# EasyEDA Pro project 压力传感器monitor.eprj

# Schematic Schematic1
Create Date: 2025-03-22; Page Name: P1; Project Name: 压力传感器monitor; Schematic Name: Schematic1; Update Date: 2025-03-22; Company: 嘉立创EDA; Page Size: A4; Version: V1.0
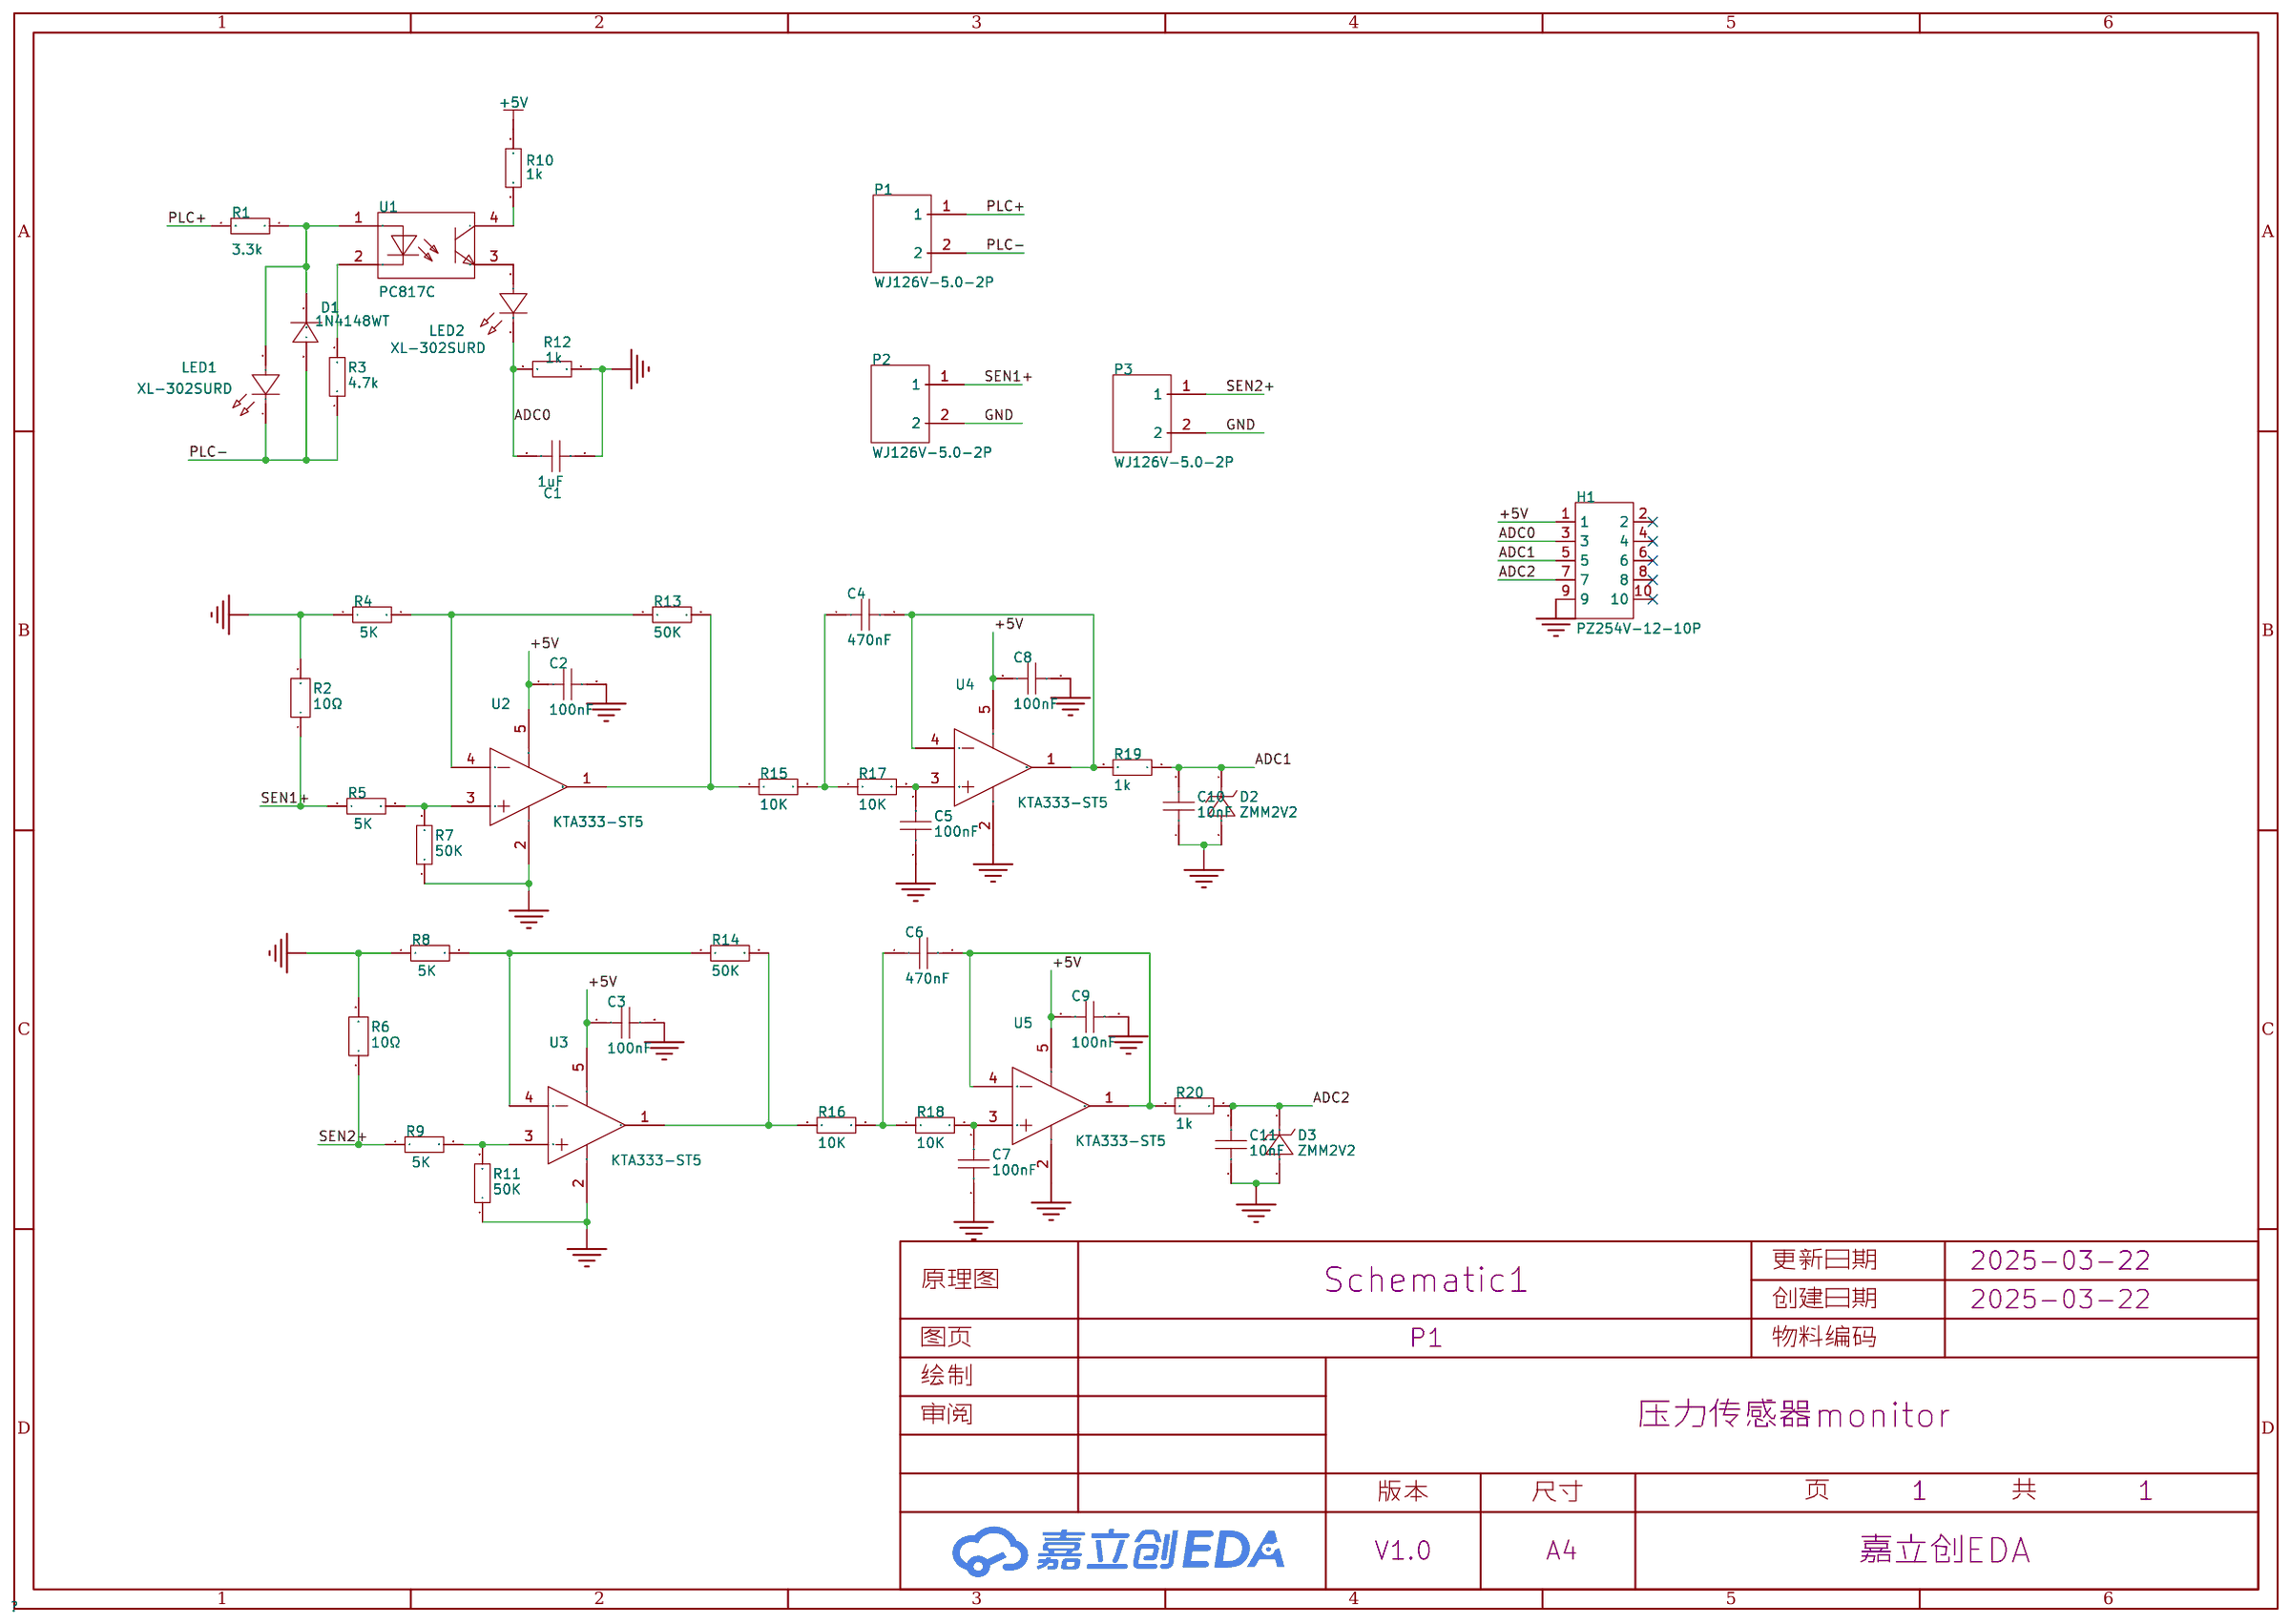
[diagram p0: schematic sheet]

## Parts
C1  1uF  [C0603]
C2  100nF  [C0603]
C3  100nF  [C0603]
C4  470nF  [C0603]
C5  100nF  [C0603]
C6  470nF  [C0603]
C7  100nF  [C0603]
C8  100nF  [C0603]
C9  100nF  [C0603]
C10  10nF  [C0603]
C11  10nF  [C0603]
D1  1N4148WT  [SOD-523_L1.2-W0.8-LS1.6-RD]
D2  ZMM2V2  [LL-34_L3.5-W1.5-RD]
D3  ZMM2V2  [LL-34_L3.5-W1.5-RD]
H1  PZ254V-12-10P  [HDR-TH_10P-P2.54-V-M-R2-C5-S2.54]
LED1  XL-302SURD  [LED-TH_BD3.8-P2.54-RD]
LED2  XL-302SURD  [LED-TH_BD3.8-P2.54-RD]
P1  WJ126V-5.0-2P  [CONN-TH_WJ126V-5.0-2P]
P2  WJ126V-5.0-2P  [CONN-TH_WJ126V-5.0-2P]
P3  WJ126V-5.0-2P  [CONN-TH_WJ126V-5.0-2P]
R1  3.3k  [R0603]
R2  10Ω  [R1206_1]
R3  4.7k  [R0603]
R4  5K  [R0603]
R5  5K  [R0603]
R6  10Ω  [R1206_1]
R7  50K  [R0603]
R8  5K  [R0603]
R9  5K  [R0603]
R10  1k  [R0603]
R11  50K  [R0603]
R12  1k  [R0603]
R13  50K  [R0603]
R14  50K  [R0603]
R15  10K  [R0603]
R16  10K  [R0603]
R17  10K  [R0603]
R18  10K  [R0603]
R19  1k  [R0603]
R20  1k  [R0603]
U1  PC817C  [OPTO-SMD-4_L4.6-W6.5-P2.54-LS10.3-TL]
U2  KTA333-ST5  [SOT-23-5_L2.9-W1.6-P0.95-LS2.8-BL]
U3  KTA333-ST5  [SOT-23-5_L2.9-W1.6-P0.95-LS2.8-BL]
U4  KTA333-ST5  [SOT-23-5_L2.9-W1.6-P0.95-LS2.8-BL]
U5  KTA333-ST5  [SOT-23-5_L2.9-W1.6-P0.95-LS2.8-BL]

## Library data of the parts
C1-C11 = CAP_0603: Supplier Footprint: 0603
D1 = 1N4148WT_C232841: 二极管配置:独立式;正向压降(Vf):1V@10mA;直流反向耐压(Vr):75V;整流电流:300mA;反向恢复时间(trr):4ns;; LCSC Part Name: 电压:75V 电流:300mA; Supplier Part: C232841; Manufacturer: onsemi(安森美); Supplier Footprint: SOD-523F; JLCPCB Part Class: Extended Part; Datasheet: https://atta.szlcsc.com/upload/public/pdf/source/20181222/C232841_42C5BA49E5A441BB8F6B91D0F4CD0D51.pdf; Supplier: LCSC; Diode Configuration: 独立式; Forward Voltage (Vf@If): 1V@10mA; Reverse Voltage (Vr): 75V; Rectified Current: 300mA; Reverse Leakage Current: 5uA@75V; Reverse Recovery Time (trr): 4ns; Operating Temperature: -55℃~+150℃@(Tj)
D2 D3 = ZMM2V2: 稳压值(标称值):-;功率:500mW;精度:-;; Supplier Part: C707185; Manufacturer: Slkor(萨科微); Supplier Footprint: LL-34; JLCPCB Part Class: Extended Part; Datasheet: https://atta.szlcsc.com/upload/public/pdf/source/20200721/C707184_776B95022AAA01ECB528B9CFDAFDB27C.pdf; Supplier: LCSC; Reverse Leakage Current (Ir): 75uA@1V; Power Dissipation: 500mW
H1 = PZ254V-12-10P: 插针结构:2x5P;间距:2.54mm;行距:2.54mm;圆针/方针:方针;安装方式:直插;排数:双排;总PIN位数:10P;额定电流:-;额定电压:-;配合针长度:6mm;塑高:2.5mm;端接针长度:3mm;触头材质:黄铜;触头镀层:-;工作温度:-40℃~+105℃;颜色:黑色;; LCSC Part Name: 2x5P 间距:2.54mm 方针 直插; Supplier Part: C492422; Manufacturer: XFCN(兴飞); Supplier Footprint: 插件,P=2.54mm; JLCPCB Part Class: Extended Part; Datasheet: https://atta.szlcsc.com/upload/public/pdf/source/20200309/C492422_5020CEA01BE7051F9EA9DD81AB0A25E3.pdf; Supplier: LCSC; Pin Structure: 2x5P; Pitch: 2.54mm; Row Spacing: 2.54mm; Circluar Pins/Square Pins: 方针; Mounting Type: 直插; Number of Rows: 双排; Number of Pins: 10P; Length of Mating Pin: 6mm; Insulation Height: 2.5mm; Length of End Connection Pin: 3mm; Contact Material: 黄铜; Operating Temperature: -40℃~+105℃; Color: 黑色
LED1 LED2 = XL-302SURD: 灯头类型:3mm圆形灯头;发光颜色:红色;功率:80mW;正向电流:30mA;主波长:615nm~620nm;透镜颜色:红色透镜;色温:-;发光角度:50°;载带方式:-;工作温度:-25℃~+85℃;; Supplier Part: C2895470; Manufacturer: XINGLIGHT(成兴光); Supplier Footprint: 插件,D=3mm; JLCPCB Part Class: Extended Part; Datasheet: https://atta.szlcsc.com/upload/public/pdf/source/20240112/E1E2B82945FD635E4907401DDE6D4922.pdf; Supplier: LCSC; Lamp Holder Type: 3mm圆形灯头; Emitted Color: 红色; Power Dissipation: 80mW; Forward Current: 30mA; Dominant Wavelength: 615nm~620nm; Peak Wavelength: 625nm; Lens Color: 红色透镜; Viewing Angle: 50°; Operating Temperature: -25℃~+85℃
P1-P3 = WJ126V-5.0-2P: 结构:1x2P;间距:5mm;颜色:绿色;安装方式:直插;额定电流:18A;额定电压:250V;排数:1;线规 - AWG:14~26;线规 - 平方毫米:2.5;每排PIN数:2;工作温度范围:-40℃~+105℃;; LCSC Part Name: 5mm 1x2P 排数:1 每排P数:2 直插; Supplier Part: C8404; Manufacturer: KANGNEX(康奈克斯电气); Supplier Footprint: 插件,P=5mm; JLCPCB Part Class: Extended Part; Datasheet: https://atta.szlcsc.com/upload/public/pdf/source/20191225/C8404_8F52D87DF851D149A4DEA9BD9FA83F9A.pdf; Supplier: LCSC; Structure: 1x2P; Pitch: 5mm; Color: 绿色; Mounting Style: 直插; Current Rating (Max): 18A; Voltage Rating (Max): 250V; Number of Pins: 2P; Number of Rows: 1; Wire Gauge - AWG: 14~26; Wire Gauge - mm2: 2.5; Number of PINs Per Row: 2; Operating Temperature Range: -40℃~+105℃
R1 R3-R5 R7-R20 = Res_0603: Supplier Footprint: 0603
R2 R6 = SR12X10R0FTL: 电阻类型:金属膜电阻;阻值:10Ω;精度:±1%;功率:250mW;温度系数:-200ppm/℃~+400ppm/℃;; LCSC Part Name: 10Ω ±1% 250mW; Supplier Part: C5356708; Manufacturer: Walsin(华新科); Supplier Footprint: 1206; JLCPCB Part Class: Extended Part; Datasheet: https://atta.szlcsc.com/upload/public/pdf/source/20190927/C431829_E85B1AD1A99EB5DCD2887E5955DF3207.pdf; Supplier: LCSC; Type: 金属膜电阻; Tolerance: ±1%; Power(Watts): 250mW; Temperature Coefficient: -200ppm/℃~+400ppm/℃
U1 = PC817C_C3025164: 输入电压类型:DC;正向压降(Vf):1.2V;输出电流:50mA;隔离电压(Vrms):5kV;反向电压:6V;负载电压:35V;输出通道数:1;集射极饱和电压(VCE(sat)):100mV@1mA,20mA;; LCSC Part Name: C档; Supplier Part: C3025164; Manufacturer: GOODWORK(固得沃克); Supplier Footprint: SMD-4P; JLCPCB Part Class: Extended Part; Datasheet: https://atta.szlcsc.com/upload/public/pdf/source/20240617/7F1B42AFA4D9649DF13B74B1E0B1F256.pdf; Supplier: LCSC; Input voltage type: DC; Output Type: 光电三极管; Forward Voltage: 1.2V; Output Current: 50mA; Isolation Voltage(rms): 5kV; Reverse Voltage: 6V; Load Voltage: 35V; Number of Outputs: 1; Collector-Emitter Saturation Voltage (Vce(sat)@Ic,IF): 100mV@1mA,20mA; Rise time: 6us@2mA,100Ω; Fall time: 5us@2mA,100Ω; Operating Temperature: -55℃~+110℃; Current Transfer Ratio (CTR) Minimum: 200%; Current Transfer Ratio (CTR) Maximum/Saturation Value: 400%
U2-U5 = KTA333-ST5: 零漂移、微功耗、CMOS 运算放大器，SOT-23-5L封装 VDD1.8~5.5供电; Supplier Part: C5180465; Manufacturer: CONNTEK(昆泰芯); Supplier Footprint: SOT-23-5; JLCPCB Part Class: Extended Part; Datasheet: https://atta.szlcsc.com/upload/public/pdf/source/20220922/5DB1813585517C535CC957AF853FD7D4.pdf; Supplier: LCSC; Maximum Power Supply Range (Vdd-Vss): 5.5V

## Nets
+5V: C2.1 C3.1 C8.1 C9.1 H1.1 R10.2 U2.5(V+) U3.5(V+) U4.5(V+) U5.5(V+)
GND: C1.1 C2.2 C3.2 C5.1 C7.1 C8.2 C9.2 C10.1 C11.1 D2.2(A) D3.2(A) H1.9 P2.2 P3.2 R2.2 R4.1 R6.2 R7.1 R8.1 R11.1 R12.1 U2.2(V-) U3.2(V-) U4.2(V-) U5.2(V-)
ADC0: C1.2 H1.3 LED2.1(K) R12.2
ADC1: C10.2 D2.1(K) H1.5 R19.1
ADC2: C11.2 D3.1(K) H1.7 R20.1
PLC+: P1.1 R1.2
PLC-: D1.2(A) LED1.1(K) P1.2 R3.1
SEN1+: P2.1 R2.1 R5.1
SEN2+: P3.1 R6.1 R9.1
$1N200: R3.2 U1.2
$1N422: D1.1(C) LED1.2(A) R1.1 U1.1
$1N1051: LED2.2(A) U1.3
$1N1090: R10.1 U1.4
$1N1367: R4.2 R13.1 U2.4(IN-)
$1N1409: R5.2 R7.2 U2.3(IN+)
$1N1586: R13.2 R15.1 U2.1(OUT)
$1N1695: C5.2 R17.2 U4.3(IN+)
$1N1869: C4.1 R15.2 R17.1
$1N3034: R8.2 R14.1 U3.4(IN-)
$1N3038: R9.2 R11.2 U3.3(IN+)
$1N3049: R14.2 R16.1 U3.1(OUT)
$1N3053: C7.2 R18.2 U5.3(IN+)
$1N3059: C6.1 R16.2 R18.1
$1N3392: C4.2 R19.2 U4.1(OUT) U4.4(IN-)
$1N3516: C6.2 R20.2 U5.1(OUT) U5.4(IN-)

Not connected (* = marked no-connect by the designer): H1 2* 4* 6* 8* 10*

# Schematic Schematic2
Create Date: 2025-03-24; Page Name: P1; Project Name: 压力传感器monitor; Schematic Name: Schematic2; Update Date: 2025-04-01; Company: 嘉立创EDA; Page Size: A4; Version: V1.0
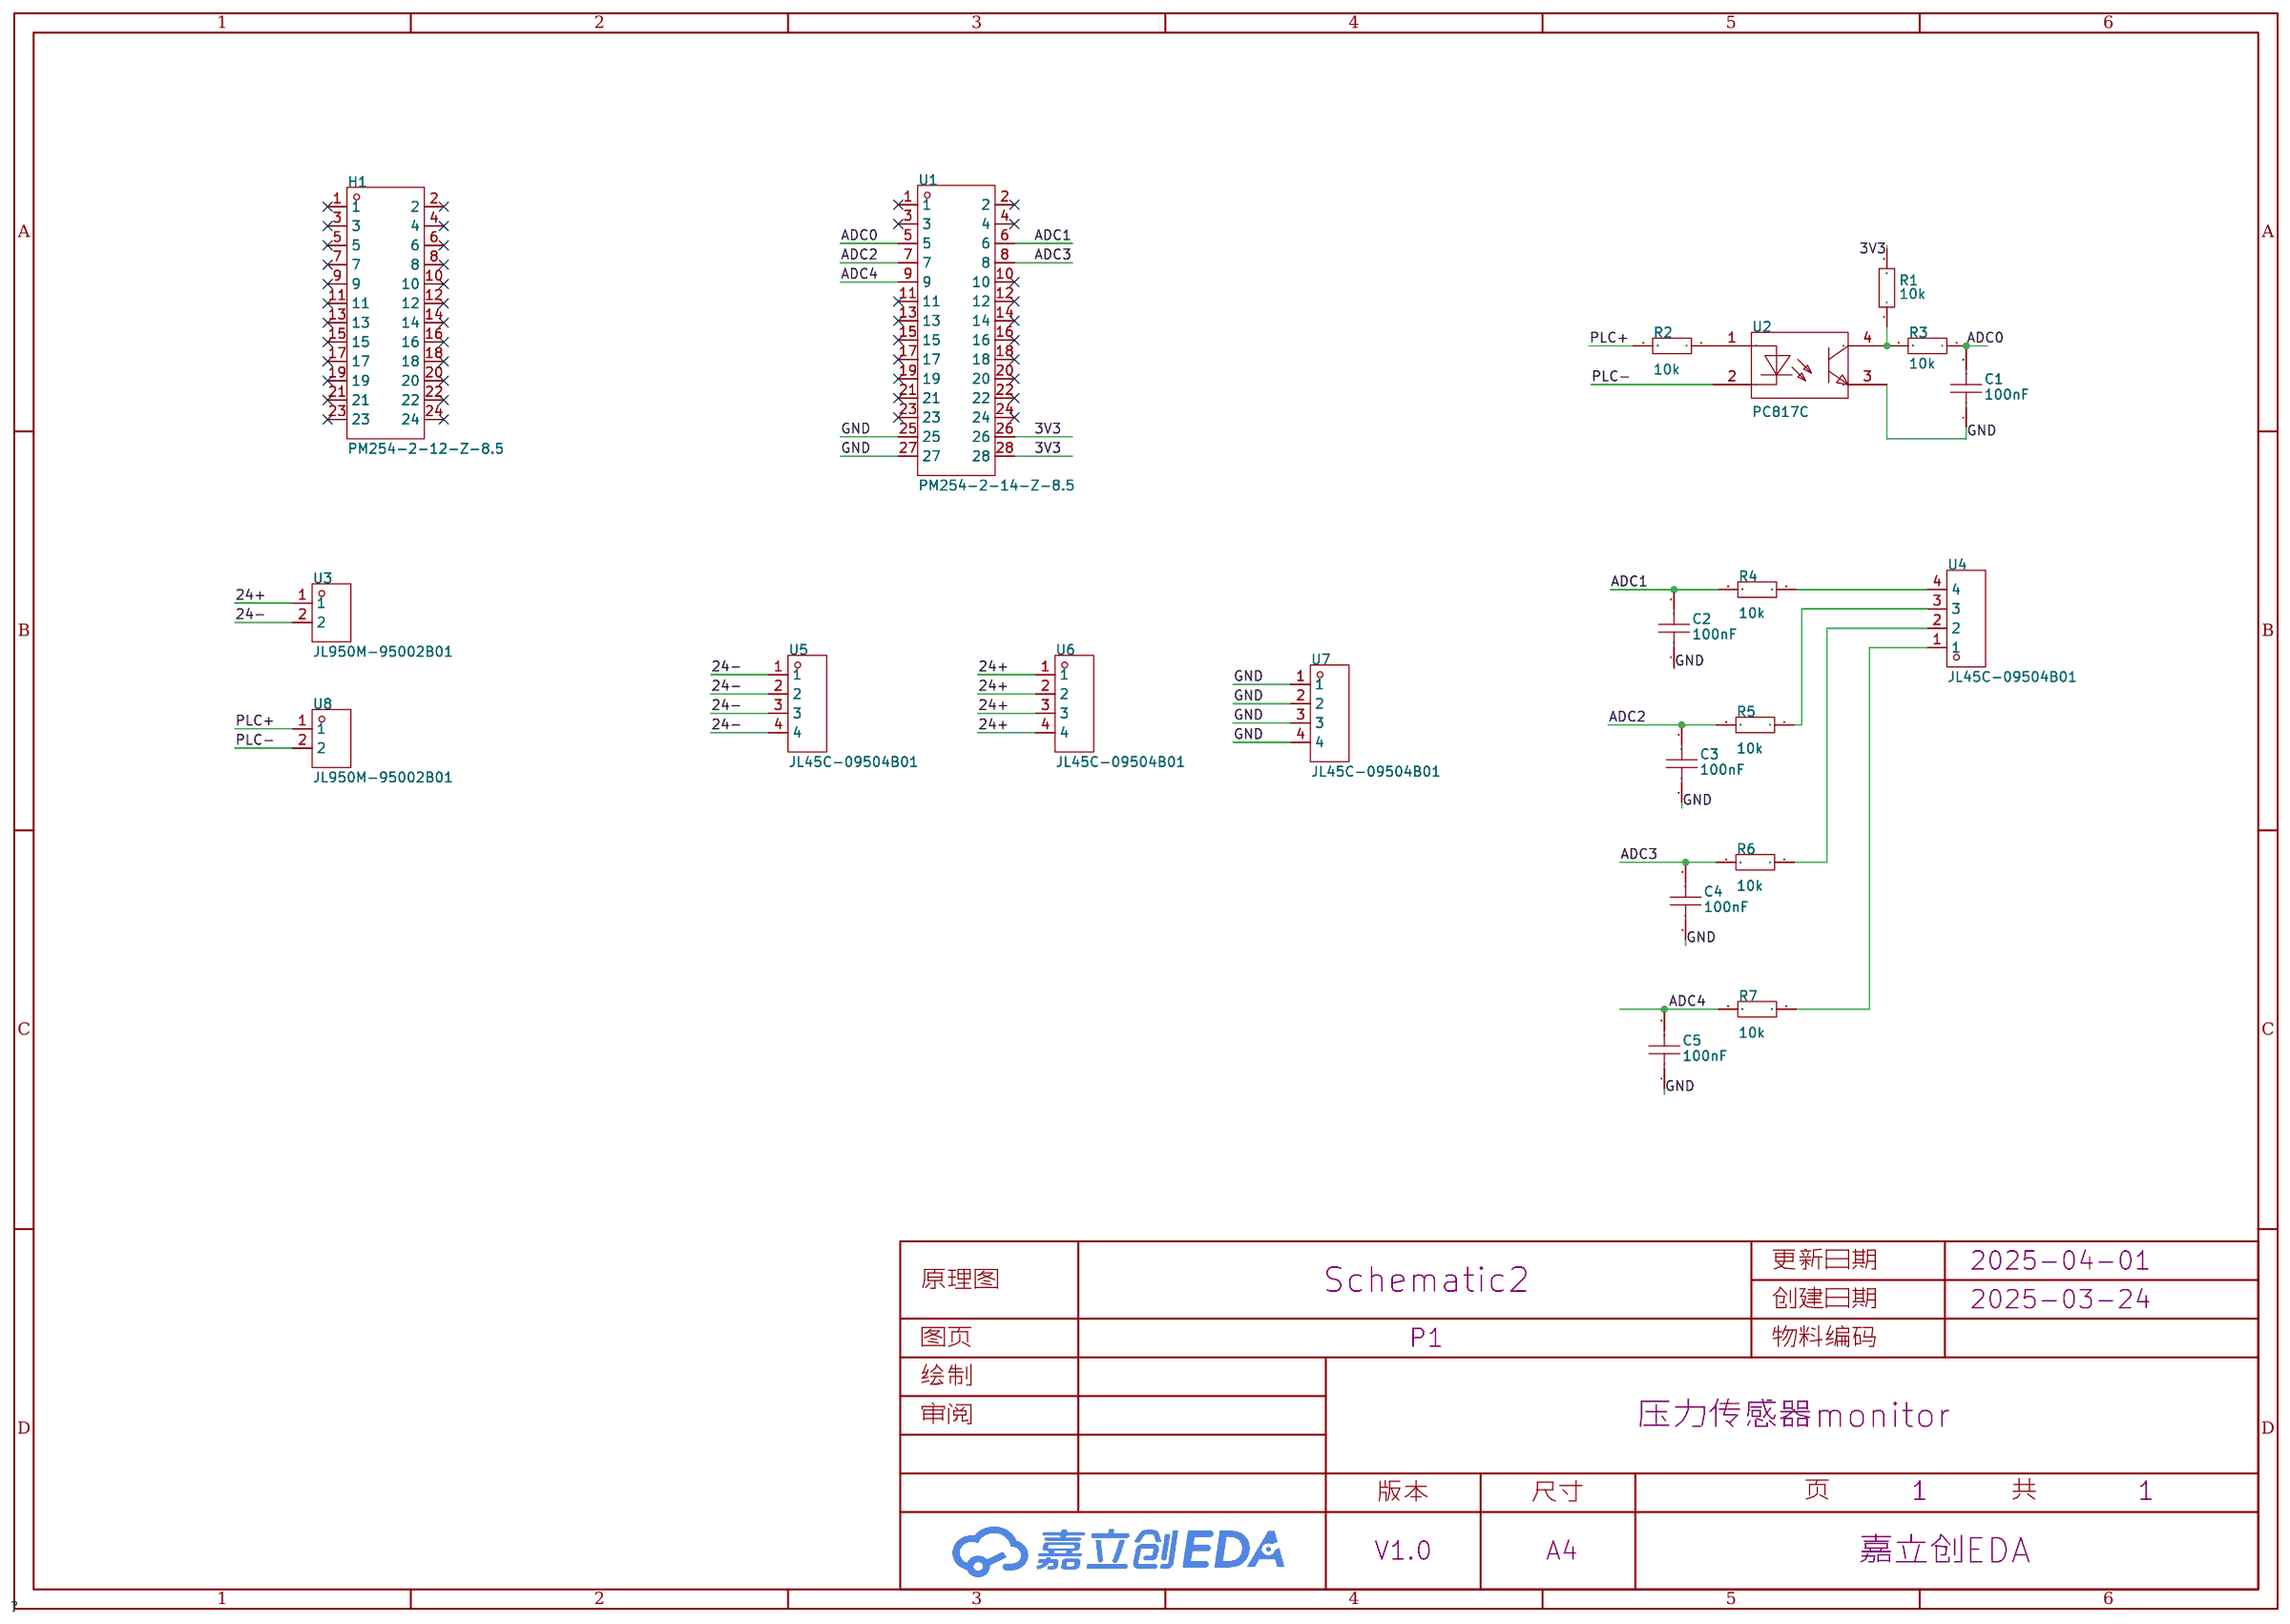
[diagram p1: schematic sheet]

## Parts
C1  100nF  [C0603]
C2  100nF  [C0603]
C3  100nF  [C0603]
C4  100nF  [C0603]
C5  100nF  [C0603]
H1  PM254-2-12-Z-8.5  [HDR-TH_24P-P2.54-V-F-R2-C12-S2.54-2]
R1  10k  [R0603]
R2  10k  [R0603]
R3  10k  [R0603]
R4  10k  [R0603]
R5  10k  [R0603]
R6  10k  [R0603]
R7  10k  [R0603]
U1  PM254-2-14-Z-8.5  [HDR-TH_28P-P2.54-V-F-R2-C14-S2.54-1]
U2  PC817C  [OPTO-SMD-4_L4.6-W6.5-P2.54-LS10.3-TL]
U3  JL950M-95002B01  [CONN-TH_JL950M-95002B01]
U4  JL45C-09504B01  [CONN-TH_JL45C-09504B01]
U5  JL45C-09504B01  [CONN-TH_JL45C-09504B01]
U6  JL45C-09504B01  [CONN-TH_JL45C-09504B01]
U7  JL45C-09504B01  [CONN-TH_JL45C-09504B01]
U8  JL950M-95002B01  [CONN-TH_JL950M-95002B01]

## Library data of the parts
C1-C5 = CAP_0603: Supplier Footprint: 0603
H1 = PM254-2-12-Z-8.5: 插孔结构:2x12P;间距:2.54mm;行距:2.54mm;圆孔/方孔:方孔;安装类型:直插;排数:双排;总孔位数:24P;额定电流:3A;额定电压:-;插孔方向:顶部;塑高:8.5mm;触头材质:铜合金;工作温度范围:-40℃~+105℃;焊接温度(最大值):260℃@5S;; LCSC Part Name: 2x12P 间距:2.54mm 直插; Supplier Part: C2897413; Manufacturer: HCTL(华灿天禄); Supplier Footprint: 插件,P=2.54mm; JLCPCB Part Class: 扩展库; Datasheet: https://atta.szlcsc.com/upload/public/pdf/source/20230609/3D36CA2C1BFC9FD1C3F709AD9DFEB9C2.pdf; Supplier: LCSC; Holes Structure: 2x12P; Pitch: 2.54mm; Row Spacing: 2.54mm; Circular Hole / Square Hole: 方孔; Mounting Type: 直插; Number of Rows: 双排; Number of Holes: 24P; Current Rating (Max): 3A; Holes Direction: 顶部; Insulation Height: 8.5mm; Contact Material: 铜合金; Operating Temperature Range: -40℃~+105℃; Soldering Temperature(Max): 260℃@5S
R1-R7 = Res_0603: Supplier Footprint: 0603
U1 = PM254-2-14-Z-8.5: 插孔结构:2x14P;间距:2.54mm;行距:2.54mm;圆孔/方孔:方孔;安装类型:直插;排数:双排;总孔位数:28P;额定电流:3A;额定电压:-;插孔方向:顶部;塑高:8.5mm;触头材质:铜合金;工作温度范围:-40℃~+105℃;焊接温度(最大值):260℃@5S;; LCSC Part Name: 2x14P 间距:2.54mm 直插; Supplier Part: C2897415; Manufacturer: HCTL(华灿天禄); Supplier Footprint: 插件,P=2.54mm; JLCPCB Part Class: 扩展库; Datasheet: https://atta.szlcsc.com/upload/public/pdf/source/20230609/3D36CA2C1BFC9FD1C3F709AD9DFEB9C2.pdf; Supplier: LCSC; Holes Structure: 2x14P; Pitch: 2.54mm; Row Spacing: 2.54mm; Circular Hole / Square Hole: 方孔; Mounting Type: 直插; Number of Rows: 双排; Number of Holes: 28P; Current Rating (Max): 3A; Holes Direction: 顶部; Insulation Height: 8.5mm; Contact Material: 铜合金; Operating Temperature Range: -40℃~+105℃; Soldering Temperature(Max): 260℃@5S
U2 = PC817C_C3025164: 输入电压类型:DC;正向压降(Vf):1.2V;输出电流:50mA;隔离电压(Vrms):5kV;反向电压:6V;负载电压:35V;输出通道数:1;集射极饱和电压(VCE(sat)):100mV@1mA,20mA;; LCSC Part Name: C档; Supplier Part: C3025164; Manufacturer: GOODWORK(固得沃克); Supplier Footprint: SMD-4P; JLCPCB Part Class: Extended Part; Datasheet: https://atta.szlcsc.com/upload/public/pdf/source/20240617/7F1B42AFA4D9649DF13B74B1E0B1F256.pdf; Supplier: LCSC; Input voltage type: DC; Output Type: 光电三极管; Forward Voltage: 1.2V; Output Current: 50mA; Isolation Voltage(rms): 5kV; Reverse Voltage: 6V; Load Voltage: 35V; Number of Outputs: 1; Collector-Emitter Saturation Voltage (Vce(sat)@Ic,IF): 100mV@1mA,20mA; Rise time: 6us@2mA,100Ω; Fall time: 5us@2mA,100Ω; Operating Temperature: -55℃~+110℃; Current Transfer Ratio (CTR) Minimum: 200%; Current Transfer Ratio (CTR) Maximum/Saturation Value: 400%
U3 U8 = JL950M-95002B01: 隔板类型:带盖板;间距:9.5mm;结构:1x2P;安装方式:直针;引脚位置:边脚;排数:1;额定电流:25A;额定电压:300V;线规 - AWG:12~22;线规 - 平方毫米:-;触头材质:黄铜;触头镀层:锡;工作温度范围:-40℃~+105℃;颜色:黑色;每排PIN数:2;; LCSC Part Name: 9.5mm 1x2P 直针 边脚 排数:1 每排P数:2; Supplier Part: C415421; Manufacturer: JILN(锦凌); Supplier Footprint: 插件,P=9.5mm; JLCPCB Part Class: 扩展库; Datasheet: https://atta.szlcsc.com/upload/public/pdf/source/20190827/C415421_09C690167420F69926D4263BE5D3047E.pdf; Supplier: LCSC; Barrier Type: 带盖板; Pitch: 9.5mm; Structure: 1x2P; Mounting Style: 直针; Pin Location: 边脚; Number of Pins: 2P; Number of Rows: 1; Current Rating (Max): 25A; Voltage Rating (Max): 300V; Wire Gauge - AWG: 12~22; Contact Material: 黄铜; Contact Plating: 锡; Operating Temperature Range: -40℃~+105℃; Color: 黑色; Number of PINs Per Row: 2; Screw Specification: M4
U4-U7 = JL45C-09504B01: 隔板类型:两面;间距:9.5mm;结构:1x4P;安装方式:直针;引脚位置:-;排数:1;额定电流:25A;额定电压:300V;线规 - AWG:22~12;线规 - 平方毫米:0.3~3;触头材质:黄铜;触头镀层:锡;工作温度范围:-40℃~+105℃;焊接温度(最大值):250℃;颜色:黑色;每排PIN数:4;; LCSC Part Name: 9.5mm 1x4P 直针 排数:1 每排P数:4; Supplier Part: C415416; Manufacturer: JILN(锦凌); Supplier Footprint: P=9.5mm; JLCPCB Part Class: 扩展库; Datasheet: https://atta.szlcsc.com/upload/public/pdf/source/20190827/C415417_C50B752FF2BCC6FCCFDC064F0FA44D1E.pdf; Supplier: LCSC; Barrier Type: 两面; Pitch: 9.5mm; Structure: 1x4P; Mounting Style: 直针; Number of Pins: 4P; Number of Rows: 1; Current Rating (Max): 25A; Voltage Rating (Max): 300V; Wire Gauge - AWG: 22~12; Wire Gauge - mm2: 0.3~3; Contact Material: 黄铜; Contact Plating: 锡; Operating Temperature Range: -40℃~+105℃; Soldering Temperature(Max): 250℃; Color: 黑色; Number of PINs Per Row: 4; Screw Specification: M4

## Nets
3V3: R1.2 U1.26 U1.28
GND: C1.1 C2.1 C3.1 C4.1 C5.1 U1.25 U1.27 U2.3 U7.1 U7.2 U7.3 U7.4
24+: U3.1 U6.1 U6.2 U6.3 U6.4
24-: U3.2 U5.1 U5.2 U5.3 U5.4
ADC0: C1.2 R3.1 U1.5
ADC1: C2.2 R4.2 U1.6
ADC2: C3.2 R5.2 U1.7
ADC3: C4.2 R6.2 U1.8
ADC4: C5.2 R7.2 U1.9
PLC+: R2.2 U8.1
PLC-: U2.2 U8.2
$1N1349: R2.1 U2.1
$1N4891: R1.1 R3.2 U2.4
$1N4959: R5.1 U4.3
$1N4997: R6.1 U4.2
$1N5038: R7.1 U4.1
$1N5356: R4.1 U4.4

Not connected (* = marked no-connect by the designer): H1 1* 2* 3* 4* 5* 6* 7* 8* 9* 10* 11* 12* 13* 14* 15* 16* 17* 18* 19* 20* 21* 22* 23* 24*; U1 1* 2* 3* 4* 10* 11* 12* 13* 14* 15* 16* 17* 18* 19* 20* 21* 22* 23* 24*

# Schematic Schematic4
Create Date: 2025-04-30; Page Name: P1; Project Name: 压力传感器monitor; Schematic Name: Schematic4; Update Date: 2025-05-05; Company: 嘉立创EDA; Page Size: A4; Version: V1.0
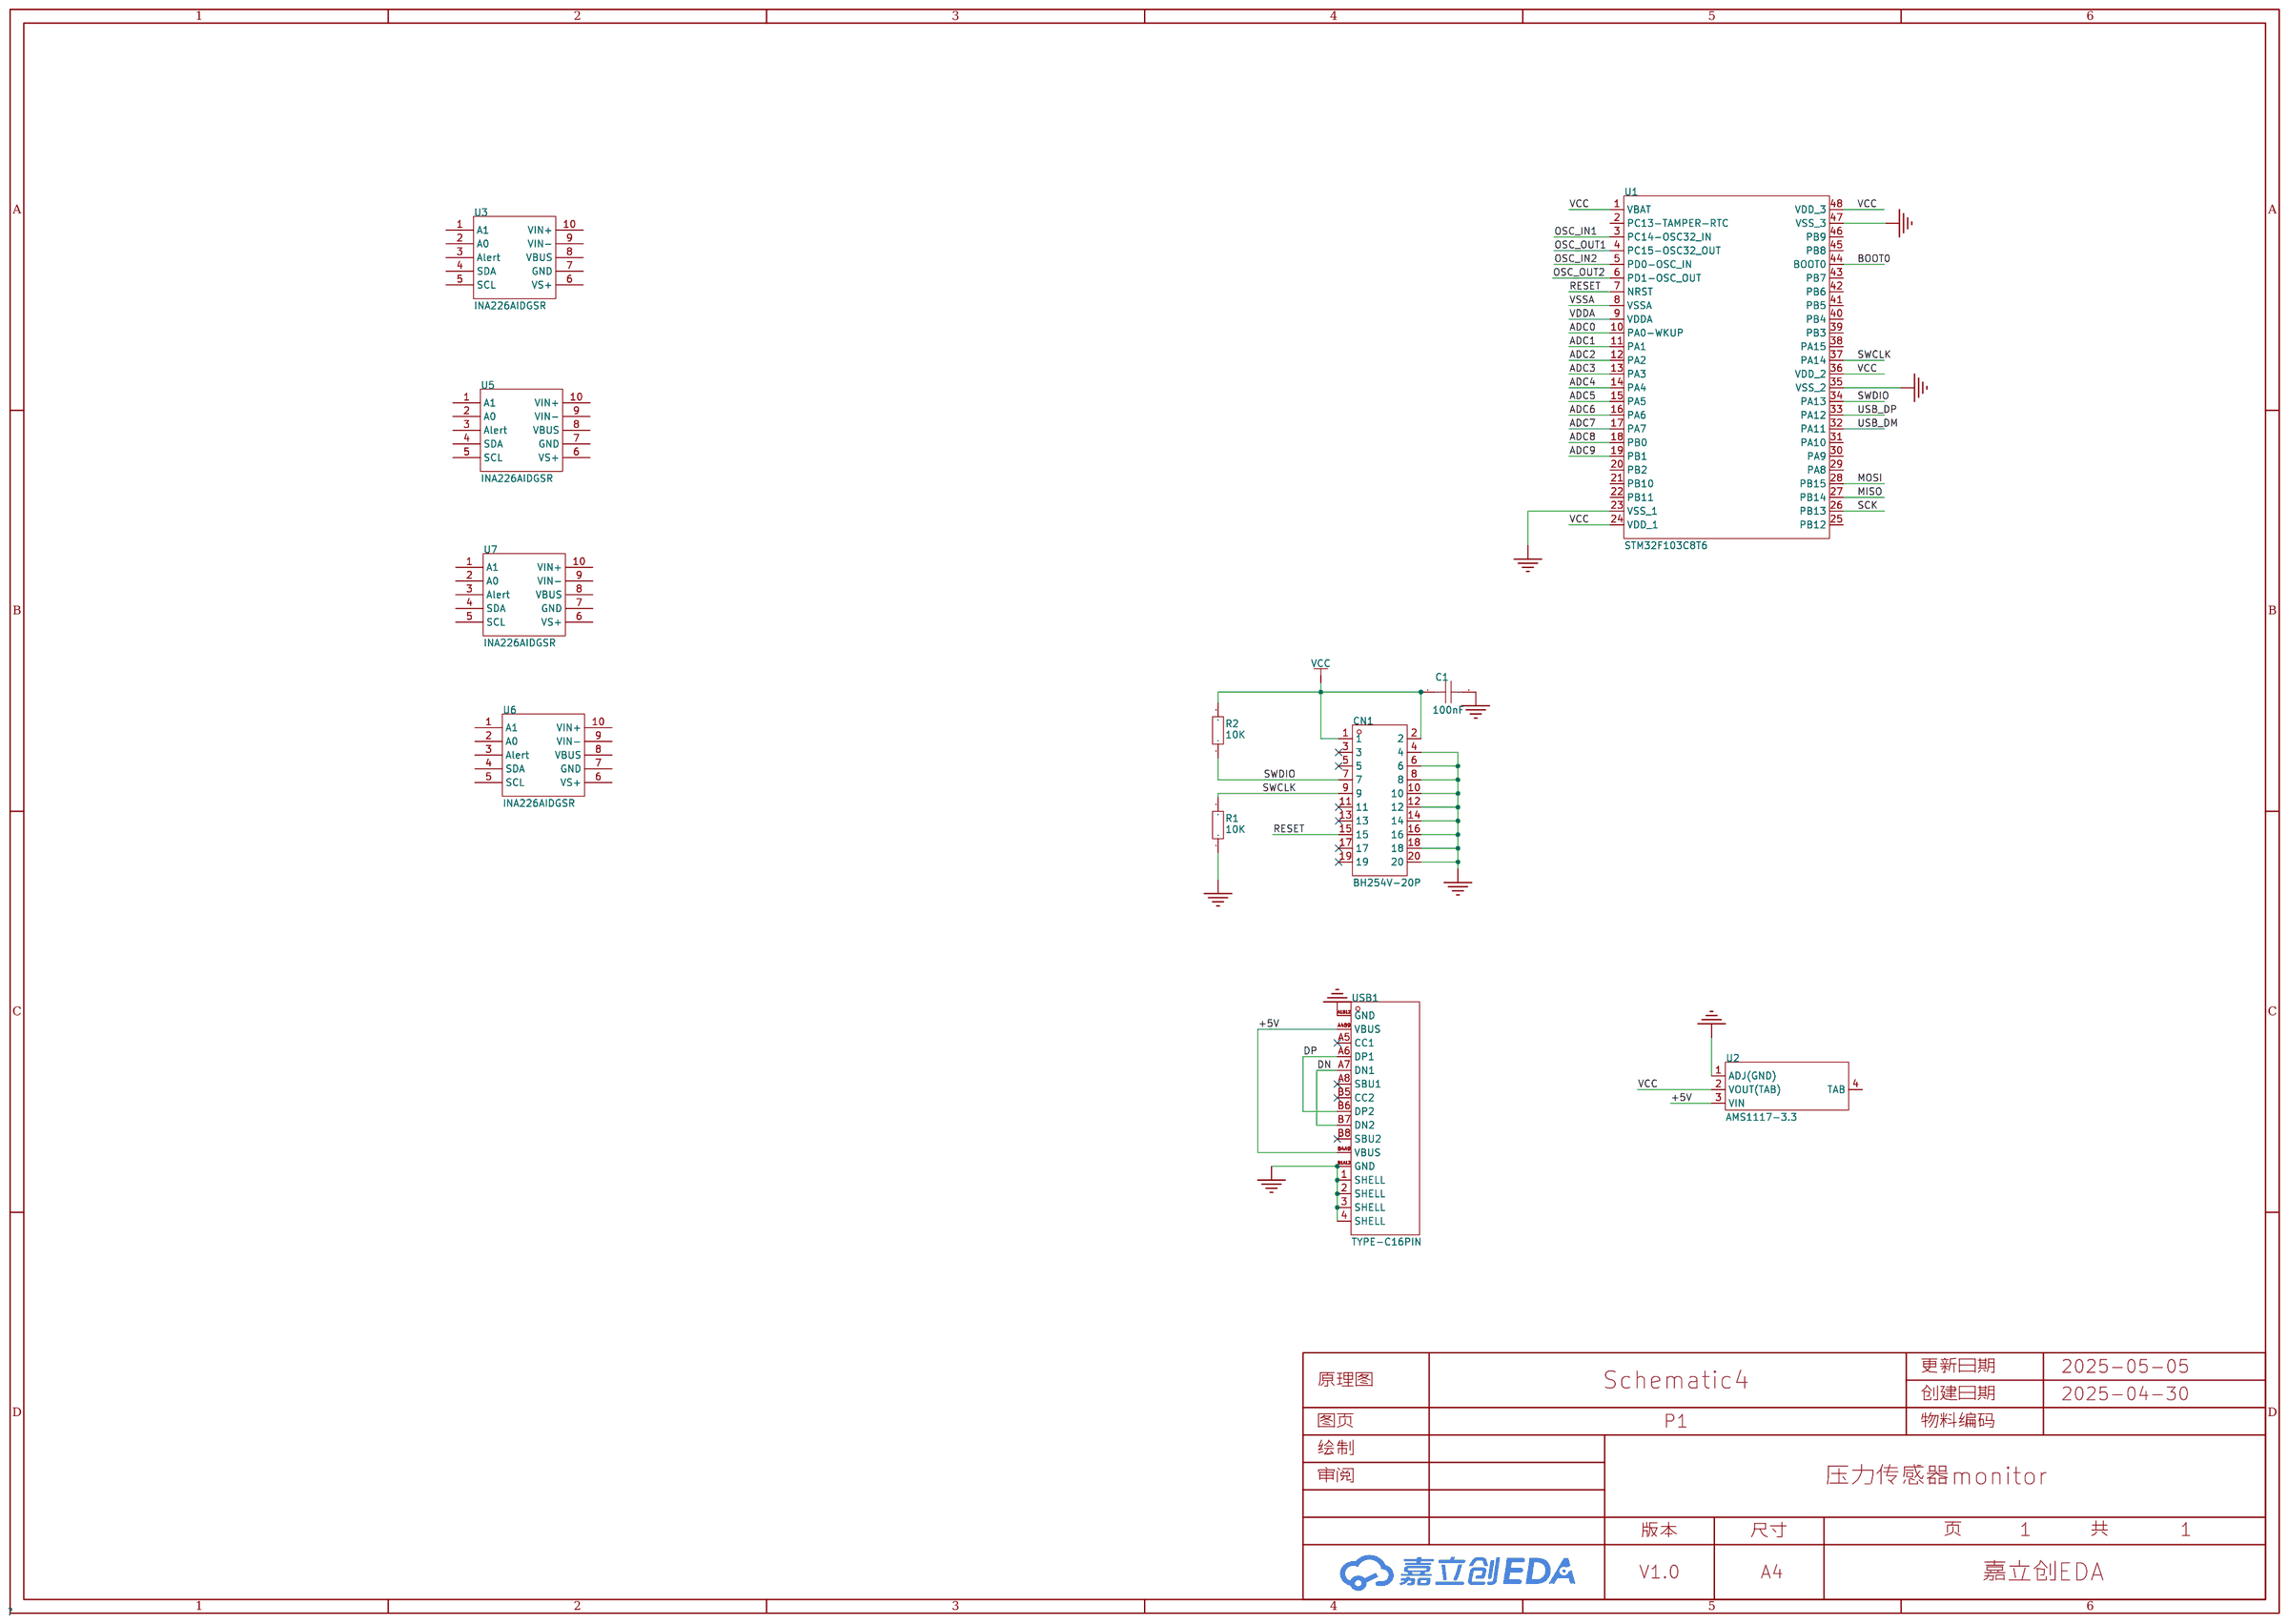
[diagram p2: schematic sheet]

## Parts
C1  100nF  [C0603]
CN1  BH254V-20P  [CONN-TH_20P-P2.54_0702462001]
R1  10K  [R0603]
R2  10K  [R0603]
U1  STM32F103C8T6  [LQFP-48_L7.0-W7.0-P0.50-LS9.0-BL]
U2  AMS1117-3.3  [SOT-223-4_L6.5-W3.5-P2.30-LS7.0-BR]
U3  INA226AIDGSR  [MSOP-10_L3.0-W3.0-P0.50-LS5.0-BL]
U5  INA226AIDGSR  [MSOP-10_L3.0-W3.0-P0.50-LS5.0-BL]
U6  INA226AIDGSR  [MSOP-10_L3.0-W3.0-P0.50-LS5.0-BL]
U7  INA226AIDGSR  [MSOP-10_L3.0-W3.0-P0.50-LS5.0-BL]
USB1  TYPE-C16PIN  [USB-C-SMD_TYPE-C16PIN]

## Library data of the parts
C1 = CAP_0603: Supplier Footprint: 0603
CN1 = BH254V-20P: 连接器类型:简牛座;间距:-;结构:2x10P;额定电流:3A;额定电压:250V;封装形式:直插;行距:2.54mm;排数:2;每排PIN数:10;触头材质:-;触头镀层:-;工作温度范围:-40℃~+105℃;焊接温度(最大值):-;; LCSC Part Name: 2x10P 排数:2 每排P数:10; Supplier Part: C492444; Manufacturer: XFCN(兴飞); Supplier Footprint: 插件,P=2.54mm; JLCPCB Part Class: 扩展库; Datasheet: https://atta.szlcsc.com/upload/public/pdf/source/20200312/C492444_4AABE2FC4F6BE8226B85135616AF0092.pdf; Supplier: LCSC; Connector Type: 简牛座; Structure: 2x10P; Current Rating (Max): 3A; Voltage Rating (Max): 250V; Holder Type: 直插; Row Spacing: 2.54mm; Number of Rows: 2; Pin Number in each Row: 10; Operating Temperature Range: -40℃~+105℃
R1 R2 = Res_0603: Supplier Footprint: 0603
U1 = STM32F103C8T6: CPU内核:ARM-M3;CPU最大主频:72MHz;应用领域:-;; LCSC Part Name: 主流增强型ARM Cortex-M3 MCU，具有64 KB Flash、72 MHz CPU、电机控制、USB和CAN; Supplier Part: C8734; Manufacturer: ST(意法半导体); Supplier Footprint: LQFP-48(7x7); JLCPCB Part Class: 扩展库; Datasheet: https://atta.szlcsc.com/upload/public/pdf/source/20220812/8363ACEC51AD55ECEB84799464F7CB85.pdf; Supplier: LCSC; CPU Core: ARM-M3; CPU Maximum Speed: 72MHz; Program Storage Size: 64KB; Program Memory Type: FLASH; Number of I/O: 37; ADC (Bit): 12bit; Low Voltage Detection Threshold: 2V~3.6V
U2 = AMS1117-3.3_C347222: 输出类型:固定;工作电压:12V;输出电压:3.3V;输出电流:1A;电源纹波抑制比(PSRR):60dB@(120Hz);输出极性:正极;; LCSC Part Name: 输出:3.3V 电流:1A 耐压:12V; Supplier Part: C347222; Manufacturer: UMW(友台半导体); Supplier Footprint: SOT-223; JLCPCB Part Class: 扩展库; Datasheet: https://atta.szlcsc.com/upload/public/pdf/source/20241218/BAF0263FA2E44BCD8AF41AA4FA04EFAA.pdf; Supplier: LCSC; Output Type: 固定; Voltage - Supply: 12V; Output Voltage: 3.3V; Output Current: 1A; Power Supply Rejection Ratio (PSRR): 60dB@(120Hz); Voltage Dropout: 1.3V@(1A); Features: 过流保护; Output Configuration: 正极; Number of Outputs: 1
U3 U5-U7 = INA226AIDGSR: INA226 支持报警功能的 36V、双向、超高精度、低侧/高侧、I2C 输出电流/功率监控器; Supplier Part: C49851; Manufacturer: TI(德州仪器); Supplier Footprint: MSOP-10; JLCPCB Part Class: 扩展库; Datasheet: https://www.ti.com/cn/lit/gpn/ina226; Supplier: LCSC; Supply Voltage: 0V~36V; Operating Temperature: -40℃~+125℃
USB1 = TYPE-C16PIN: 连接器类型:Type-C;标准:USB 3.1;公母:母;安装方式:卧贴;触点数量:16P;端口数量:1;额定电流 - 电源:3A;工作温度范围:-40℃~+85℃;; LCSC Part Name: Type-C 母 卧贴; Supplier Part: C393939; Manufacturer: SHOU HAN(首韩); Supplier Footprint: SMD; JLCPCB Part Class: 扩展库; Datasheet: https://atta.szlcsc.com/upload/public/pdf/source/20190521/C393939_7B9043D4CF1026AF443AB60D91FBCD5C.pdf; Supplier: LCSC; Connector Type: Type-C; Standard: USB 3.1; Gender: 母; Mounting Style: 卧贴; Number of Contacts: 16P; Number of Ports: 1; Current Rating - Power (Max): 3A; Operating Temperature Range: -40℃~+85℃; Rated Voltage (Max): 30V; Connect-Disconnect Life: 1万次; Core Colour: 黑色

## Nets
+5V: U2.3(VIN) USB1.A4B9(VBUS) USB1.B4A9(VBUS)
GND: C1.2 CN1.4 CN1.6 CN1.8 CN1.10 CN1.12 CN1.14 CN1.16 CN1.18 CN1.20 R1.1 U1.23(VSS_1) U1.35(VSS_2) U1.47(VSS_3) U2.1(ADJ(GND)) USB1.1(SHELL) USB1.2(SHELL) USB1.3(SHELL) USB1.4(SHELL) USB1.A1B12(GND) USB1.B1A12(GND)
VCC: C1.1 CN1.1 CN1.2 R2.2 U1.1(VBAT) U1.24(VDD_1) U1.36(VDD_2) U1.48(VDD_3) U2.2(VOUT(TAB))
VDDA: U1.9(VDDA)
VSSA: U1.8(VSSA)
ADC0: U1.10(PA0-WKUP)
ADC1: U1.11(PA1)
ADC2: U1.12(PA2)
ADC3: U1.13(PA3)
ADC4: U1.14(PA4)
ADC5: U1.15(PA5)
ADC6: U1.16(PA6)
ADC7: U1.17(PA7)
ADC8: U1.18(PB0)
ADC9: U1.19(PB1)
BOOT0: U1.44(BOOT0)
DN: USB1.A7(DN1) USB1.B7(DN2)
DP: USB1.A6(DP1) USB1.B6(DP2)
MISO: U1.27(PB14)
MOSI: U1.28(PB15)
OSC_IN1: U1.3(PC14-OSC32_IN)
OSC_IN2: U1.5(PD0-OSC_IN)
OSC_OUT1: U1.4(PC15-OSC32_OUT)
OSC_OUT2: U1.6(PD1-OSC_OUT)
RESET: CN1.15 U1.7(NRST)
SCK: U1.26(PB13)
SWCLK: CN1.9 R1.2 U1.37(PA14)
SWDIO: CN1.7 R2.1 U1.34(PA13)
USB_DM: U1.32(PA11)
USB_DP: U1.33(PA12)

Not connected (* = marked no-connect by the designer): CN1 3* 5* 11* 13* 17* 19*; U1 2(PC13-TAMPER-RTC) 20(PB2) 21(PB10) 22(PB11) 25(PB12) 29(PA8) 30(PA9) 31(PA10) 38(PA15) 39(PB3) 40(PB4) 41(PB5) 42(PB6) 43(PB7) 45(PB8) 46(PB9); U2 4(TAB); U3 1(A1) 2(A0) 3(Alert) 4(SDA) 5(SCL) 6(VS+) 7(GND) 8(VBUS) 9(VIN-) 10(VIN+); U5 1(A1) 2(A0) 3(Alert) 4(SDA) 5(SCL) 6(VS+) 7(GND) 8(VBUS) 9(VIN-) 10(VIN+); U6 1(A1) 2(A0) 3(Alert) 4(SDA) 5(SCL) 6(VS+) 7(GND) 8(VBUS) 9(VIN-) 10(VIN+); U7 1(A1) 2(A0) 3(Alert) 4(SDA) 5(SCL) 6(VS+) 7(GND) 8(VBUS) 9(VIN-) 10(VIN+); USB1 A5(CC1)* A8(SBU1)* B5(CC2)* B8(SBU2)*

# Schematic Schematic5
Create Date: 2025-05-05; Page Name: P1; Project Name: 压力传感器monitor; Schematic Name: Schematic5; Update Date: 2025-05-05; Company: 嘉立创EDA; Page Size: A4; Version: V1.0
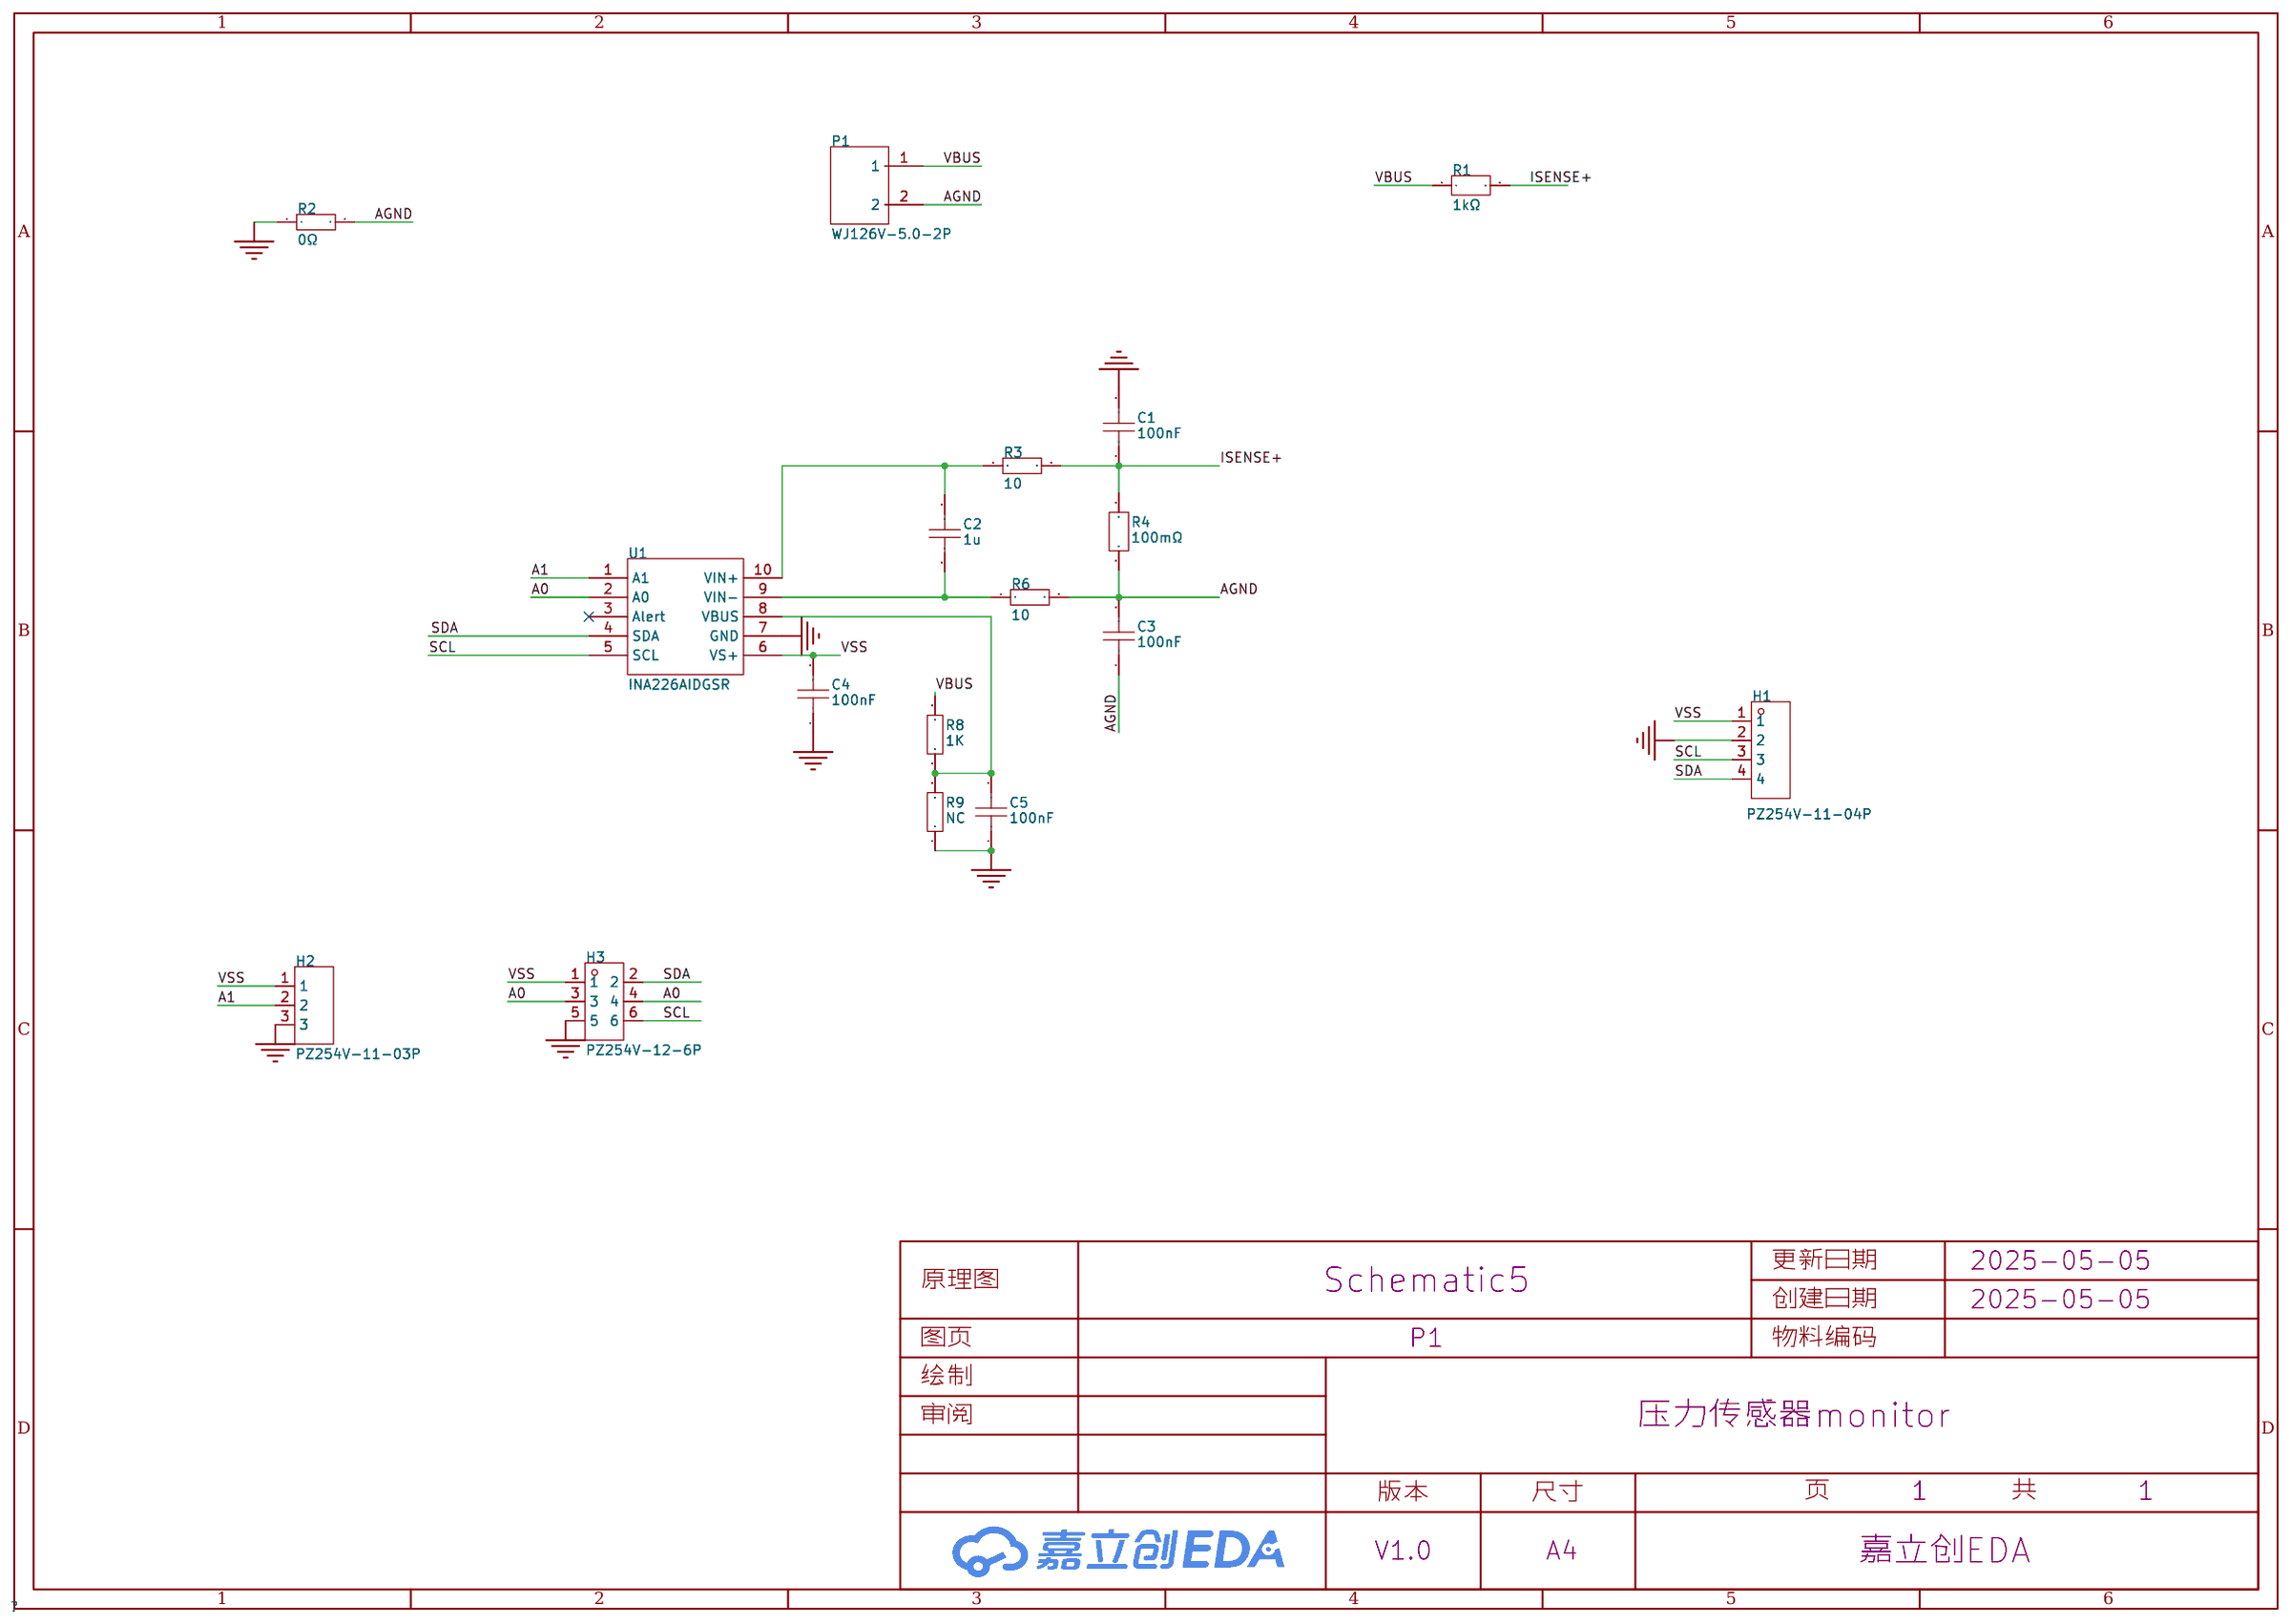
[diagram p3: schematic sheet]

## Parts
C1  100nF  [C0603]
C2  1u  [C0603]
C3  100nF  [C0603]
C4  100nF  [C0603]
C5  100nF  [C0603]
H1  PZ254V-11-04P  [HDR-TH_4P-P2.54-V-M]
H2  PZ254V-11-03P  [HDR-TH_3P-P2.54-V-M]
H3  PZ254V-12-6P  [HDR-TH_6P-P2.54-V-M-R2-C3-S2.54]
P1  WJ126V-5.0-2P  [CONN-TH_WJ126V-5.0-2P]
R1  1kΩ  [RES-TH_BD2.7-L6.2-P10.20-D0.4]
R2  0Ω  [R0805]
R3  10  [R0603]
R4  100mΩ  [R2512]
R6  10  [R0603]
R8  1K  [R0603]
R9  NC  [R0603]
U1  INA226AIDGSR  [MSOP-10_L3.0-W3.0-P0.50-LS5.0-BL]

## Library data of the parts
C1-C5 = CAP_0603: Supplier Footprint: 0603
H1 = PZ254V-11-04P: 插针结构:1x4P;间距:2.54mm;行距:-;圆针/方针:方针;安装类型:直插;排数:单排;总PIN位数:4P;额定电流:3A;额定电压:250V;配合针长度:6mm;塑高:2.5mm;端接针长度:3mm;触头材质:-;工作温度范围:-40℃~+105℃;颜色:黑色;; LCSC Part Name: 间距:2.54mm 1x4P 直插 方针; Supplier Part: C2691448; Manufacturer: XFCN(兴飞); Supplier Footprint: 插件,P=2.54mm; JLCPCB Part Class: Extended Part; Datasheet: https://atta.szlcsc.com/upload/public/pdf/source/20200309/C492403_F9F19131791D08044AD4F84F8E751A34.pdf; Supplier: LCSC; Pin Structure: 1x4P; Pitch: 2.54mm; Circluar Pins/Square Pins: 方针; Mounting Type: 直插; Number of Rows: 单排; Number of Pins: 4P; Current Rating (Max): 3A; Voltage Rating (Max): 250V; Length of Mating Pin: 6mm; Insulation Height: 2.5mm; Length of End Connection Pin: 3mm; Operating Temperature Range: -40℃~+105℃; Color: 黑色
H2 = PZ254V-11-03P: 插针结构:1x3P;间距:2.54mm;行距:-;圆针/方针:方针;安装方式:直插;排数:单排;总PIN位数:3P;额定电流:3A;额定电压:250V;配合针长度:6mm;塑高:2.5mm;端接针长度:3mm;工作温度:-40℃~+105℃;颜色:黑色;; LCSC Part Name: 1x3P 间距:2.54mm 方针 直插; Supplier Part: C2937625; Manufacturer: XFCN(兴飞); Supplier Footprint: 插件,P=2.54mm; JLCPCB Part Class: 扩展库; Datasheet: https://atta.szlcsc.com/upload/public/pdf/source/20200309/C492402_8335C3D49C4E4C618838D59BB1D024C1.pdf; Supplier: LCSC; Pin Structure: 1x3P; Pitch: 2.54mm; Circluar Pins/Square Pins: 方针; Mounting Type: 直插; Number of Rows: 单排; Number of Pins: 3P; Current Rating: 3A; Voltage Rating (Max): 250V; Length of Mating Pin: 6mm; Insulation Height: 2.5mm; Length of End Connection Pin: 3mm; Operating Temperature: -40℃~+105℃; Color: 黑色
H3 = PZ254V-12-6P: 插针结构:2x3P;间距:2.54mm;行距:2.54mm;圆针/方针:方针;安装类型:直插;排数:双排;总PIN位数:6P;额定电流:-;额定电压:-;配合针长度:6mm;塑高:2.5mm;端接针长度:3mm;触头材质:黄铜;触头镀层:-;工作温度范围:-40℃~+105℃;颜色:黑色;; LCSC Part Name: 间距:2.54mm 2x3P 直插 方针; Supplier Part: C492420; Manufacturer: XFCN(兴飞); Supplier Footprint: 插件,P=2.54mm; JLCPCB Part Class: 扩展库; Datasheet: https://atta.szlcsc.com/upload/public/pdf/source/20200309/C492420_BAECB307B001054C09D200388220EAE6.pdf; Supplier: LCSC; Pin Structure: 2x3P; Pitch: 2.54mm; Row Spacing: 2.54mm; Circluar Pins/Square Pins: 方针; Mounting Type: 直插; Number of Rows: 双排; Number of Pins: 6P; Length of Mating Pin: 6mm; Insulation Height: 2.5mm; Length of End Connection Pin: 3mm; Contact Material: 黄铜; Operating Temperature Range: -40℃~+105℃; Color: 黑色
P1 = WJ126V-5.0-2P: 结构:1x2P;间距:5mm;颜色:绿色;安装方式:直插;额定电流:18A;额定电压:250V;排数:1;线规 - AWG:14~26;线规 - 平方毫米:2.5;每排PIN数:2;工作温度范围:-40℃~+105℃;; LCSC Part Name: 5mm 1x2P 排数:1 每排P数:2 直插; Supplier Part: C8404; Manufacturer: KANGNEX(康奈克斯电气); Supplier Footprint: 插件,P=5mm; JLCPCB Part Class: Extended Part; Datasheet: https://atta.szlcsc.com/upload/public/pdf/source/20191225/C8404_8F52D87DF851D149A4DEA9BD9FA83F9A.pdf; Supplier: LCSC; Structure: 1x2P; Pitch: 5mm; Color: 绿色; Mounting Style: 直插; Current Rating (Max): 18A; Voltage Rating (Max): 250V; Number of Pins: 2P; Number of Rows: 1; Wire Gauge - AWG: 14~26; Wire Gauge - mm2: 2.5; Number of PINs Per Row: 2; Operating Temperature Range: -40℃~+105℃
R1 = MF1/4W-1K±1%-ST52: 电阻类型:金属膜电阻;阻值:1kΩ;精度:±1%;功率:250mW;温度系数:±100ppm/℃;; LCSC Part Name: 金属膜电阻 1kΩ ±1% 250mW; Supplier Part: C2903245; Manufacturer: VO(翔胜); Supplier Footprint: 插件,D2.7xL6.2mm; JLCPCB Part Class: 扩展库; Datasheet: https://atta.szlcsc.com/upload/public/pdf/source/20200609/C601728_5AA4C0C8E12E11069DA2C3356F29D1F2.pdf; Supplier: LCSC; Type: 金属膜电阻; Tolerance: ±1%; Overload Voltage (Max): 250V; Power(Watts): 250mW; Temperature Coefficient: ±100ppm/℃; Operating Temperature Range: -55℃~+155℃
R2 = 0805W8F0000T5E: 电阻类型:厚膜电阻;阻值:0Ω;精度:±1%;功率:125mW;最大工作电压:150V;温度系数:±800ppm/℃;; LCSC Part Name: 0Ω ±1% 125mW 厚膜电阻; Supplier Part: C17477; Manufacturer: UNI-ROYAL(厚声); Supplier Footprint: 0805; JLCPCB Part Class: 基础库; Datasheet: https://atta.szlcsc.com/upload/public/pdf/source/20200306/C422600_1E6D84923E4A46A82E41ADD87F860B5C.pdf; Supplier: LCSC; Type: 厚膜电阻; Tolerance: ±1%; Power(Watts): 125mW; Overload Voltage (Max): 150V; Temperature Coefficient: ±800ppm/℃; Operating Temperature Range: -55℃~+155℃
R3 R6 R8 R9 = Res_0603: Supplier Footprint: 0603
R4 = PCSR2512BR100M6: 电阻类型:采样电阻;阻值:100mΩ;精度:±0.1%;功率:1W;温度系数:±15ppm/℃;安装方式:贴片;; LCSC Part Name: 100mΩ ±0.1% 1W; Supplier Part: C23067426; Manufacturer: RESI(开步睿思); Supplier Footprint: 2512; JLCPCB Part Class: 扩展库; Datasheet: https://atta.szlcsc.com/upload/public/pdf/source/20240812/6A4EF035CB1C2ED40D0FBE2EC738B70A.pdf; Supplier: LCSC; Type: 采样电阻; Tolerance: ±0.1%; Power(Watts): 1W; Temperature Coefficient: ±15ppm/℃; Mounting Type: 贴片
U1 = INA226AIDGSR: INA226 支持报警功能的 36V、双向、超高精度、低侧/高侧、I2C 输出电流/功率监控器; Supplier Part: C49851; Manufacturer: TI(德州仪器); Supplier Footprint: MSOP-10; JLCPCB Part Class: 扩展库; Datasheet: https://www.ti.com/cn/lit/gpn/ina226; Supplier: LCSC; Supply Voltage: 0V~36V; Operating Temperature: -40℃~+125℃

## Nets
AGND: C3.1 C3.2 P1.2 R2.2 R4.1 R6.2
GND: C1.2 C4.1 C5.1 H1.2 H2.3 H3.5 R2.1 R9.1 U1.7(GND)
VBUS: P1.1 R1.1 R8.2
VSS: C4.2 H1.1 H2.1 H3.1 U1.6(VS+)
A0: H3.3 H3.4 U1.2(A0)
A1: H2.2 U1.1(A1)
ISENSE+: C1.1 R1.2 R3.2 R4.2
SCL: H1.3 H3.6 U1.5(SCL)
SDA: H1.4 H3.2 U1.4(SDA)
Net-(C2-1): C2.1 R6.1 U1.9(VIN-)
Net-(C2-2): C2.2 R3.1 U1.10(VIN+)
Net-(C5-2): C5.2 R8.1 R9.2 U1.8(VBUS)

Not connected (* = marked no-connect by the designer): U1 3(Alert)*

# Schematic Schematic6
Create Date: 2025-05-06; Page Name: P1; Project Name: 压力传感器monitor; Schematic Name: Schematic6; Update Date: 2025-05-06; Company: 嘉立创EDA; Page Size: A4; Version: V1.0
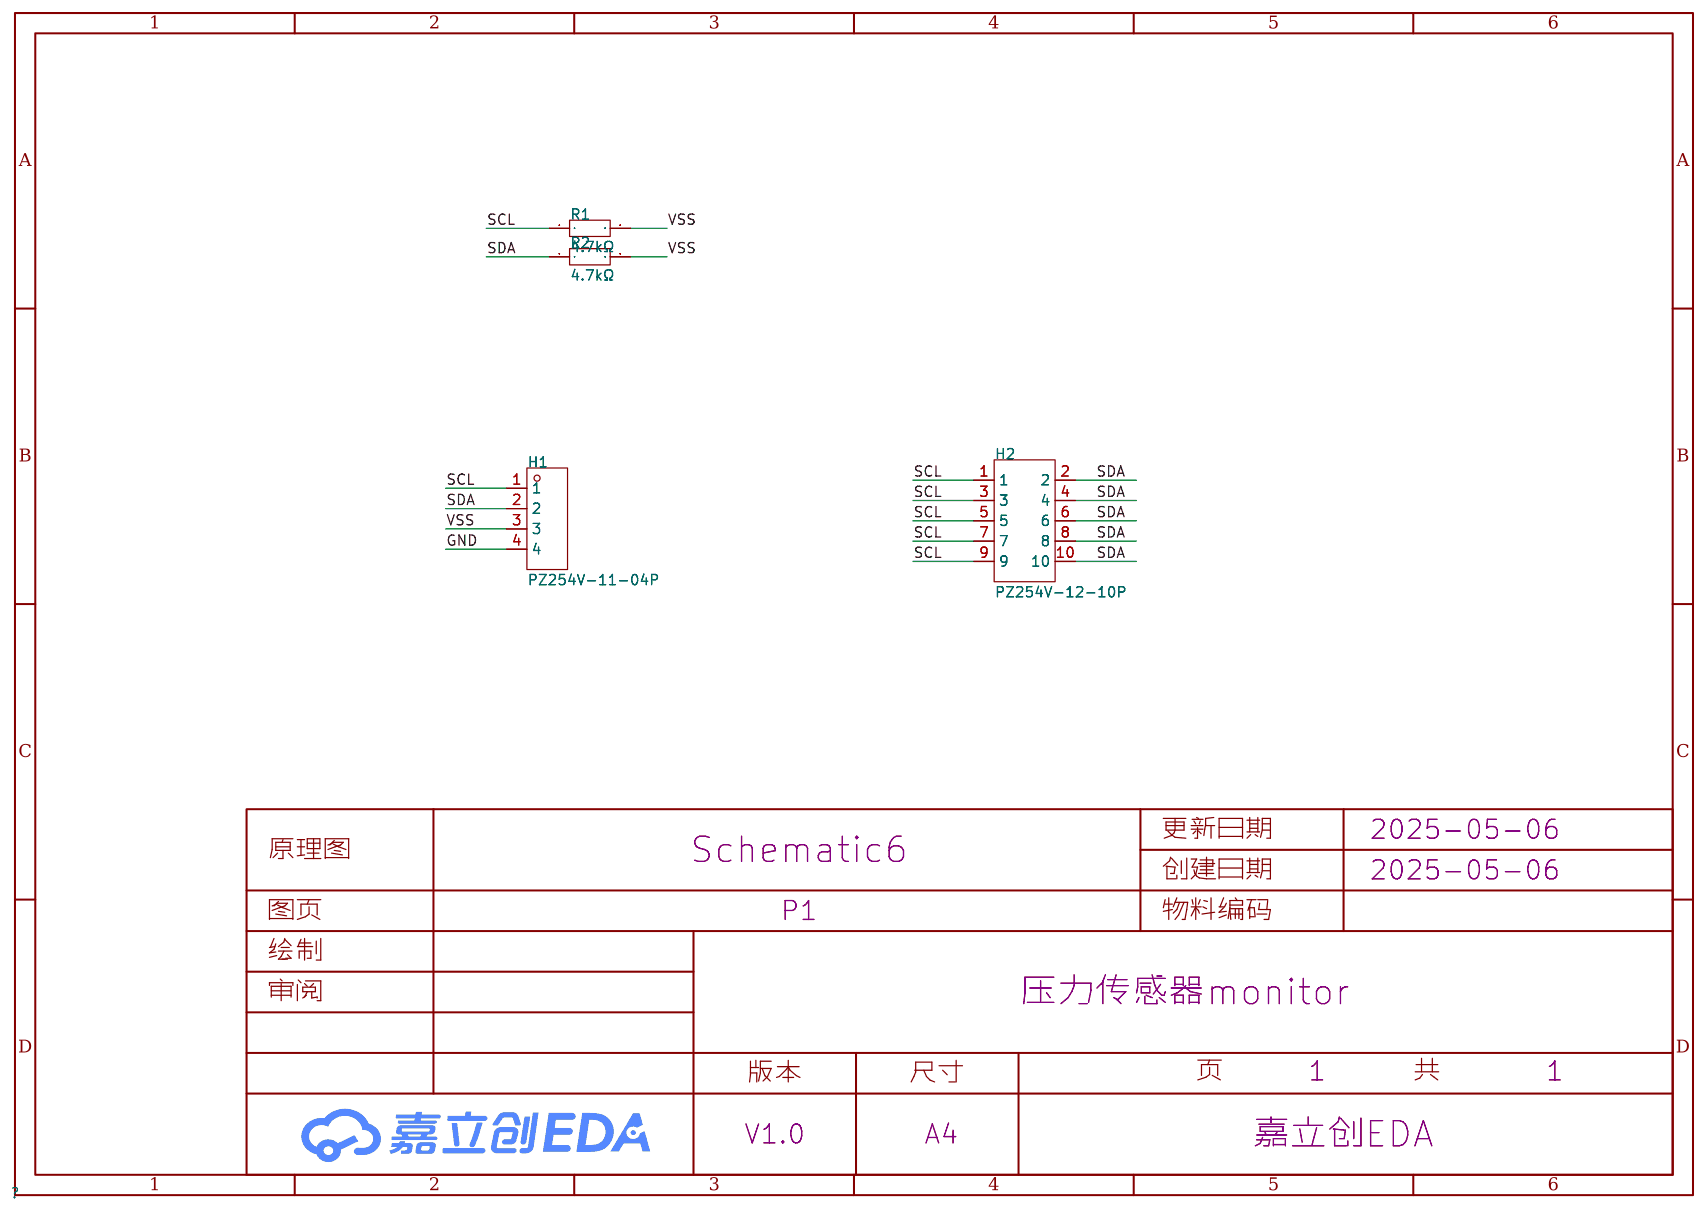
[diagram p4: schematic sheet]

## Parts
H1  PZ254V-11-04P  [HDR-TH_4P-P2.54-V-M]
H2  PZ254V-12-10P  [HDR-TH_10P-P2.54-V-M-R2-C5-S2.54]
R1  4.7kΩ  [RES-TH_BD2.3-L6.5-P10.50-D0.5]
R2  4.7kΩ  [RES-TH_BD2.3-L6.5-P10.50-D0.5]

## Library data of the parts
H1 = PZ254V-11-04P: 插针结构:1x4P;间距:2.54mm;行距:-;圆针/方针:方针;安装类型:直插;排数:单排;总PIN位数:4P;额定电流:3A;额定电压:250V;配合针长度:6mm;塑高:2.5mm;端接针长度:3mm;触头材质:-;工作温度范围:-40℃~+105℃;颜色:黑色;; LCSC Part Name: 间距:2.54mm 1x4P 直插 方针; Supplier Part: C2691448; Manufacturer: XFCN(兴飞); Supplier Footprint: 插件,P=2.54mm; JLCPCB Part Class: Extended Part; Datasheet: https://atta.szlcsc.com/upload/public/pdf/source/20200309/C492403_F9F19131791D08044AD4F84F8E751A34.pdf; Supplier: LCSC; Pin Structure: 1x4P; Pitch: 2.54mm; Circluar Pins/Square Pins: 方针; Mounting Type: 直插; Number of Rows: 单排; Number of Pins: 4P; Current Rating (Max): 3A; Voltage Rating (Max): 250V; Length of Mating Pin: 6mm; Insulation Height: 2.5mm; Length of End Connection Pin: 3mm; Operating Temperature Range: -40℃~+105℃; Color: 黑色
H2 = PZ254V-12-10P: 插针结构:2x5P;间距:2.54mm;行距:2.54mm;圆针/方针:方针;安装方式:直插;排数:双排;总PIN位数:10P;额定电流:-;额定电压:-;配合针长度:6mm;塑高:2.5mm;端接针长度:3mm;触头材质:黄铜;触头镀层:-;工作温度:-40℃~+105℃;颜色:黑色;; LCSC Part Name: 2x5P 间距:2.54mm 方针 直插; Supplier Part: C492422; Manufacturer: XFCN(兴飞); Supplier Footprint: 插件,P=2.54mm; JLCPCB Part Class: Extended Part; Datasheet: https://atta.szlcsc.com/upload/public/pdf/source/20200309/C492422_5020CEA01BE7051F9EA9DD81AB0A25E3.pdf; Supplier: LCSC; Pin Structure: 2x5P; Pitch: 2.54mm; Row Spacing: 2.54mm; Circluar Pins/Square Pins: 方针; Mounting Type: 直插; Number of Rows: 双排; Number of Pins: 10P; Length of Mating Pin: 6mm; Insulation Height: 2.5mm; Length of End Connection Pin: 3mm; Contact Material: 黄铜; Operating Temperature: -40℃~+105℃; Color: 黑色
R1 R2 = MF1/4W-4.7KΩ±1% T: 电阻类型:金属膜电阻;阻值:4.7kΩ;精度:±1%;功率:250mW;温度系数:±100ppm/℃;; LCSC Part Name: 4.7kΩ ±1% 250mW 金属膜电阻; Supplier Part: C119339; Manufacturer: CCO(千志电子); Supplier Footprint: 插件,D2.3xL6.5mm; JLCPCB Part Class: 扩展库; Datasheet: https://atta.szlcsc.com/upload/public/pdf/source/20190910/C427326_62A6D058BC0FF74963A2F22379CA06CE.pdf; Supplier: LCSC; Type: 金属膜电阻; Tolerance: ±1%; Voltage-Supply(Max): 250V; Power(Watts): 250mW; Temperature Coefficient: ±100ppm/℃; Operating Temperature: -55℃~+155℃

## Nets
GND: H1.4
VSS: H1.3 R1.2 R2.2
SCL: H1.1 H2.1 H2.3 H2.5 H2.7 H2.9 R1.1
SDA: H1.2 H2.2 H2.4 H2.6 H2.8 H2.10 R2.1

# Board PCB1
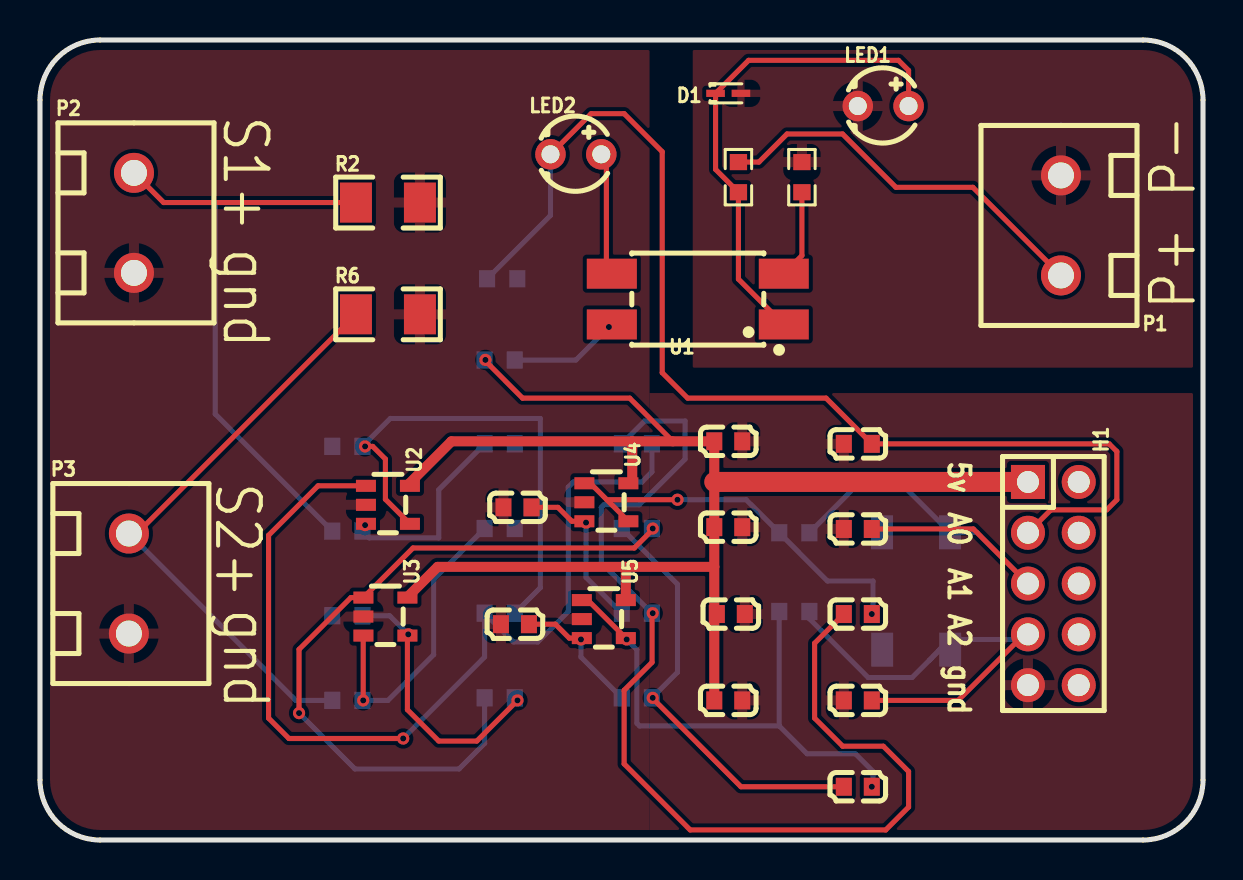
[diagram p5: board, top side]
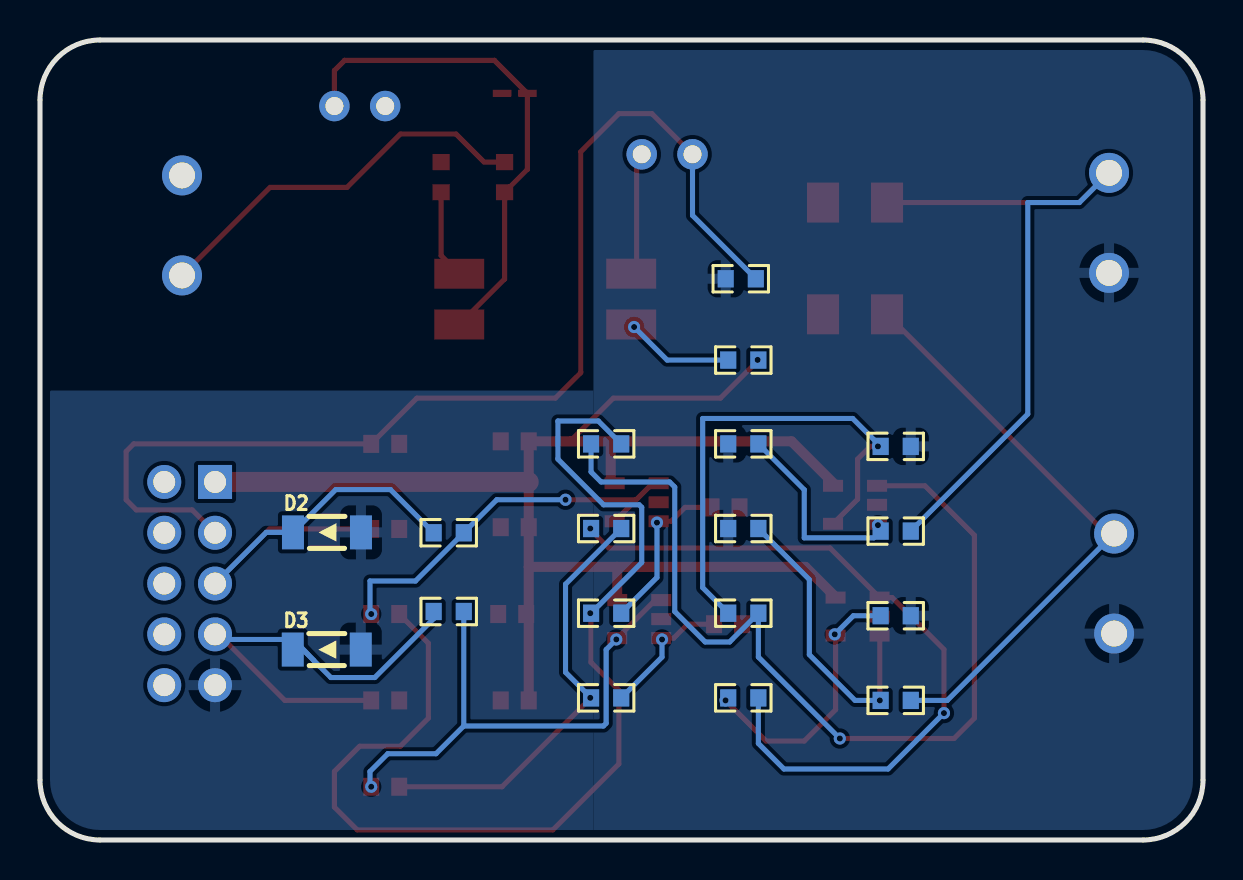
[diagram p6: board, bottom side, seen from below]

Outline 58.16 x 40 mm; copper layers: Top Layer, Bottom Layer. Coordinates in mm from the lower left corner of the outline.
Outline path: 0,37 0,3 arc(0.88,0.88) 3,0 55.16,0 arc(57.28,0.88) 58.16,3 58.16,37 arc(57.28,39.12) 55.16,40 3,40 arc(0.88,39.12) 0,37
Stack: Top Layer 0.035mm / Dielectric1 1.51mm FR4 er 4.5 / Bottom Layer 0.035mm

## Design rules (mm)
template: 自定义配置
spacing copperThickness1oz (default): track to track 0.102, other pairs 0.152 to 0.3
spacing copperThickness2oz: track to track 0.203, other pairs 0.152 to 0.3
track width copperThickness1oz (default): min 0.127, default 0.254, max 2.54
track width copperThickness2oz: min 0.203, default 0.254, max 2.54
differential pair differentialPair (default): width min 0.127, default 0.254, max 2.54; gap min 0.152, default 0.152
via viaSize (default): diameter min 0.5, default 0.61, max 10; hole min 0.3, default 0.305, max 6.3

## Placement (name value [footprint] x y rotation side)
C1  1uF  [C0603]  40.89 19.81 0 top
C2  100nF  [C0603]  34.42 19.93 0 top
C3  100nF  [C0603]  34.42 15.64 0 top
C4  470nF  [C0603]  40.89 11.3 0 top
C5  100nF  [C0603]  23.88 16.63 0 top
C6  470nF  [C0603]  40.89 2.66 0 top
C7  100nF  [C0603]  23.75 10.79 0 top
C8  100nF  [C0603]  34.42 6.98 0 top
C9  100nF  [C0603]  34.54 11.3 0 top
C10  10nF  [C0603]  40.89 15.55 0 top
C11  10nF  [C0603]  40.89 6.98 0 top
D1  1N4148WT  [SOD-523_L1.2-W0.8-LS1.6-RD]  34.42 37.33 0 top
D2  ZMM2V2  [LL-34_L3.5-W1.5-RD]  43.81 15.38 180 bottom
D3  ZMM2V2  [LL-34_L3.5-W1.5-RD]  43.81 9.52 180 bottom
H1  PZ254V-12-10P  [HDR-TH_10P-P2.54-V-M-R2-C5-S2.54]  50.67 12.82 270 top
LED1  XL-302SURD  [LED-TH_BD3.8-P2.54-RD]  42.16 36.7 0 top
LED2  XL-302SURD  [LED-TH_BD3.8-P2.54-RD]  26.8 34.28 0 top
P1  WJ126V-5.0-2P  [CONN-TH_WJ126V-5.0-2P]  51.05 30.73 180 top
P2  WJ126V-5.0-2P  [CONN-TH_WJ126V-5.0-2P]  4.7 30.86 0 top
P3  WJ126V-5.0-2P  [CONN-TH_WJ126V-5.0-2P]  4.45 12.82 0 top
R1  3.3k  [R0603]  34.93 33.14 90 top
R2  10Ω  [R1206_1]  17.4 31.87 0 top
R3  4.7k  [R0603]  38.1 33.14 270 top
R4  5K  [R0603]  15.37 19.68 0 bottom
R5  5K  [R0603]  15.37 15.45 0 bottom
R6  10Ω  [R1206_1]  17.4 26.28 0 top
R7  50K  [R0603]  22.99 19.81 180 bottom
R8  5K  [R0603]  15.37 11.21 0 bottom
R9  5K  [R0603]  15.37 6.98 0 bottom
R10  1k  [R0603]  22.99 24 180 bottom
R11  50K  [R0603]  22.99 15.57 180 bottom
R12  1k  [R0603]  23.11 28.06 180 bottom
R13  50K  [R0603]  22.99 11.34 180 bottom
R14  50K  [R0603]  22.99 7.11 180 bottom
R15  10K  [R0603]  29.84 19.81 180 bottom
R16  10K  [R0603]  29.84 15.57 180 bottom
R17  10K  [R0603]  29.84 11.34 180 bottom
R18  10K  [R0603]  29.84 7.11 180 bottom
R19  1k  [R0603]  37.72 15.36 180 bottom
R20  1k  [R0603]  37.72 11.42 180 bottom
U1  PC817C  [OPTO-SMD-4_L4.6-W6.5-P2.54-LS10.3-TL]  32.89 27.05 180 top
U2  KTA333-ST5  [SOT-23-5_L2.9-W1.6-P0.95-LS2.8-BL]  17.4 16.76 270 top
U3  KTA333-ST5  [SOT-23-5_L2.9-W1.6-P0.95-LS2.8-BL]  17.27 11.17 270 top
U4  KTA333-ST5  [SOT-23-5_L2.9-W1.6-P0.95-LS2.8-BL]  28.32 16.89 270 top
U5  KTA333-ST5  [SOT-23-5_L2.9-W1.6-P0.95-LS2.8-BL]  28.19 11.04 270 top

## Footprints (pads in the part's own frame, mm; a bottom-side part is the same pattern mirrored in y, then rotated)
C0603
  rect 0.8x0.9 smd: 1(-0.7,0) 2(0.7,0)
CONN-TH_WJ126V-5.0-2P
  round 2 hole 1.3: 1(0,2.501) 2(0,-2.501)
HDR-TH_10P-P2.54-V-M-R2-C5-S2.54
  rect 1.7x1.7 hole 1.1: 1(-5.08,-1.27)
  round 1.7 hole 1.1: 2(-5.08,1.27) 3(-2.54,-1.27) 4(-2.54,1.27) 5(0,-1.27) 6(0,1.27) 7(2.54,-1.27) 8(2.54,1.27) 9(5.08,-1.27) 10(5.08,1.27)
LED-TH_BD3.8-P2.54-RD
  round 1.524 hole 0.9: 1(-1.27,0) 2(1.27,0)
LL-34_L3.5-W1.5-RD
  rect 1.1x1.7 smd: 1(-1.7,0) 2(1.7,0)
OPTO-SMD-4_L4.6-W6.5-P2.54-LS10.3-TL
  rect 2.5x1.5 smd: 1(-4.3,1.27) 2(-4.3,-1.27) 3(4.3,-1.27) 4(4.3,1.27)
R0603
  rect 0.806x0.864 smd: 1(-0.753,0) 2(0.753,0)
R1206_1
  rect 1.6x2 smd: 1(-1.6,0) 2(1.6,0)
SOD-523_L1.2-W0.8-LS1.6-RD
  rect 0.93x0.36 smd: 1(-0.635,0) 2(0.635,0)
SOT-23-5_L2.9-W1.6-P0.95-LS2.8-BL
  rect 0.6x1 smd: 1(-0.95,-1.1) 2(0,-1.1) 3(0.95,-1.1) 4(0.95,1.1) 5(-0.95,1.1)

## Nets
As in the schematic.

Pads without a net: H1 2 4 6 8 10

## Via types
v1: diameter 0.61, hole 0.305, Top Layer to Bottom Layer, 18 vias

## Routing (per net, layer and track width the routed paths; a pad name or vN(x,y) marks a point on that pad's centre or on a via; arc(x,y) is an arc through that point)
+5V: length 75.7
  Top Layer w0.254: 31.65,19.93 29.49,22.09 24.13,22.09 22.35,23.87 22.35,24
  Top Layer w0.5: 18.35,12.12 19.88,13.66 29.29,13.66 ; 29.61,19.93 20.57,19.93 18.35,17.71 ; 29.61,19.93 C2.1 C3.1 33.72,13.66 ; 29.61,19.93 29.61,17.9 ; 33.72,13.66 C8.1 ; 33.72,13.66 29.29,13.66 ; 29.29,13.66 U5.5
  Top Layer w1: H1.1 33.72,17.9
  vias: v1(22.27,24)
ADC0: length 57.7
  Top Layer w0.254: LED2.1 27.56,36.32 29.21,36.32 31.12,34.41 31.12,23.36 32.38,22.09 39.31,22.09 C1.2 53.47,19.81 53.85,19.43 53.85,17.01 53.34,16.5 50.55,16.5 49.4,15.36
  Bottom Layer w0.254: R12.2 25.53,31.23 LED2.1
ADC1: length 22.7
  Top Layer w0.254: H1.5 46.67,15.55 C10.2
  Bottom Layer w0.254: H1.5 46.84,15.38 D2.1 43.37,17.52 40.63,17.52 R19.1
ADC2: length 24.1
  Top Layer w0.254: C11.2 45.91,6.98 49.21,10.28 H1.7
  Bottom Layer w0.254: 44.47,8.99 43.61,8.12 41.41,8.12 38.47,11.07 R20.1 ; 44.47,8.99 45.47,10.03 45.52,10.03 ; 44.47,8.99 45.52,10.03 ; H1.7 49.15,10.03 45.52,10.03
PLC+: length 19.6
  Top Layer w0.254: R1.2 35.95,33.9 37.36,35.3 40.13,35.3 42.8,32.63 46.65,32.63 P1.1
SEN1+: length 35.2
  Top Layer w0.254: P2.1 6.18,31.87 R2.1
  Bottom Layer w0.254: R5.1 8.76,21.3 8.76,31.87 6.18,31.87 P2.1
SEN2+: length 29.5
  Top Layer w0.254: P3.1 4.84,15.32 R6.1
  Bottom Layer w0.254: P3.1 12.79,6.98 R9.1
$1N200: length 4.4
  Top Layer w0.254: R3.2 38.1,29.22 37.19,28.32
$1N422: length 25.3
  Top Layer w0.254: LED1.2 43.43,38.48 42.93,38.98 35.43,38.98 D1.1 33.78,33.53 R1.1 34.93,28.04 U1.1
$1N1051: length 6.2
  Top Layer w0.254: LED2.2 28.32,34.03 28.32,28.59 28.59,28.32
$1N1090: length 5.4
  Bottom Layer w0.254: v1(28.45,25.65) 26.8,24 R10.1
$1N1367: length 24.8
  Top Layer w0.254: v1(16.26,19.68) 16.64,19.68 17.27,19.05 17.27,17.04 U2.4
  Bottom Layer w0.254: R13.1 25.02,12.62 25.02,21.08 17.52,21.08 R4.2
$1N1409: length 9.6
  Bottom Layer w0.254: R7.2 19.94,17.51 19.94,15.11 16.46,15.11 R5.2
  vias: v1(16.26,15.74)
$1N1586: length 47.7
  Top Layer w0.254: v1(18.16,5.08) 12.45,5.08 11.43,6.09 11.43,15.23 13.9,17.71 U2.1
  Bottom Layer w0.254: R15.1 30.6,18.4 30.1,17.9 26.67,17.9 26.42,17.65 26.42,11.42 24.89,9.9 23.67,9.9 R13.2 22.23,9.15 v1(18.16,5.08)
$1N1695: length 8.2
  Top Layer w0.254: C5.2 25.9,16.63 26.59,15.94 U4.3
  Bottom Layer w0.254: v1(27.31,15.87) 27.31,13.13 R17.2
$1N1869: length 54.6
  Top Layer w0.254: 30.61,11.3 30.61,8.88 29.21,7.49 29.21,3.8 32.51,0.5 42.29,0.5 43.43,1.65 43.43,3.42 42.17,4.69 40.14,4.69 38.74,6.09 38.74,9.84 C4.1
  Bottom Layer w0.254: R17.1 28.07,13.87 28.07,16.63 28.19,16.76 29.97,16.76 32.26,19.05 32.26,20.95 30.23,20.95 R15.2
  vias: v1(30.64,11.34)
$1N3034: length 13.4
  Top Layer w0.254: U3.4 18.37,6.52 19.94,4.95 21.84,4.95 v1(23.88,6.98)
  Bottom Layer w0.254: R8.2 17.48,11.21 v1(18.41,10.28)
$1N3038: length 15.1
  Top Layer w0.254: U3.3 16.16,10.21 v1(16.16,6.98)
  Bottom Layer w0.254: R11.2 19.69,13.02 19.69,9.27 17.4,6.98 R9.2
$1N3049: length 36.7
  Top Layer w0.254: 30.73,15.49 30.61,15.49 29.72,14.6 18.65,14.6 U3.1 15.55,12.12 12.95,9.53 v1(12.95,6.34)
  Bottom Layer w0.254: v1(12.95,6.34) 15.75,3.55 20.96,3.55 22.23,4.83 R14.2
  vias: v1(30.64,15.57)
$1N3053: length 6.7
  Top Layer w0.254: U5.3 26.47,10.09 25.77,10.79 C7.2
  Bottom Layer w0.254: v1(27.05,10.03) 27.05,9.15 R18.2
$1N3059: length 21.5
  Top Layer w0.254: C6.1 35.05,2.66 30.73,6.98 30.61,6.98
  Bottom Layer w0.254: R18.1 31.88,8.39 31.88,12.79 R16.2
  vias: v1(30.64,7.11)
$1N3392: length 19.6
  Top Layer w0.254: U4.1 27.52,17.84 28.34,17.01 ; 28.34,17.01 v1(31.88,17.01) ; 28.34,17.01 U4.4
  Bottom Layer w0.254: 41.66,11.3 41.66,12.95 39.38,12.95 R19.2 35.31,17.01 v1(31.88,17.01)
  vias: v1(41.59,11.3)
$1N3516: length 26.7
  Top Layer w0.254: U5.1 27.39,11.99 U5.4
  Bottom Layer w0.254: v1(29.34,10.03) 29.84,9.52 29.84,5.84 29.98,5.7 36.97,5.7 ; R20.2 36.97,5.7 ; 36.97,5.7 38.35,4.31 40.77,4.31 41.66,3.42 41.66,2.66
  vias: v1(41.59,2.66)

## Copper pours and planes (outline as drawn; the poured copper is in the pictures)
GND on Top Layer: 16.76,22.35 65.91,22.35 65.91,-8.9 16.76,-8.9
GND on Top Layer: -5.46,42.16 30.48,42.16 30.48,-2.55 -5.46,-2.55
GND on Bottom Layer: 16.89,22.47 66.04,22.47 66.04,-8.77 16.89,-8.77
GND on Bottom Layer: -5.46,42.16 30.48,42.16 30.48,-2.55 -5.46,-2.55
PLC- on Top Layer: 32.64,41.14 61.09,41.14 61.09,23.62 32.64,23.62

## Text on the board
Top Silkscreen Layer: 5v | A0 | A1 | gnd | A2 | P- | P+ | S2+ | S1+

# Board PCB2
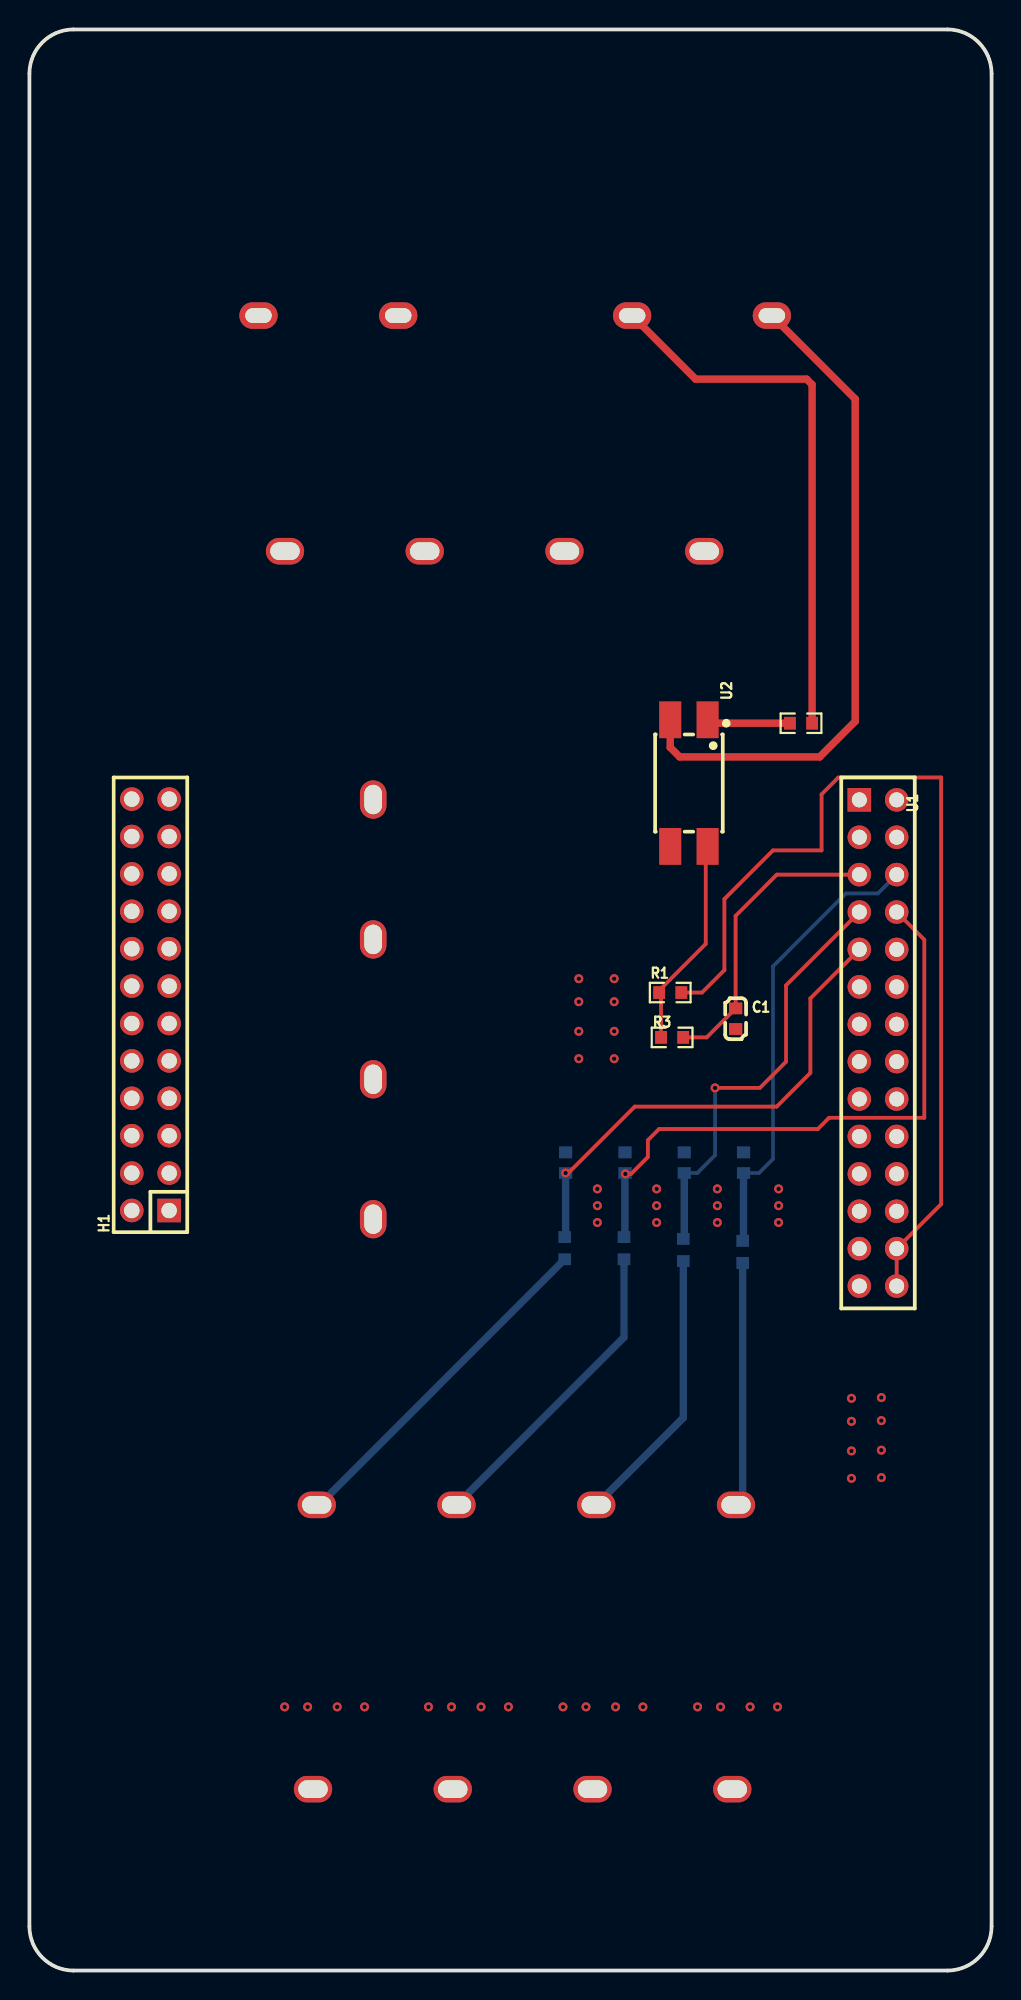
[diagram p7: board, top side]
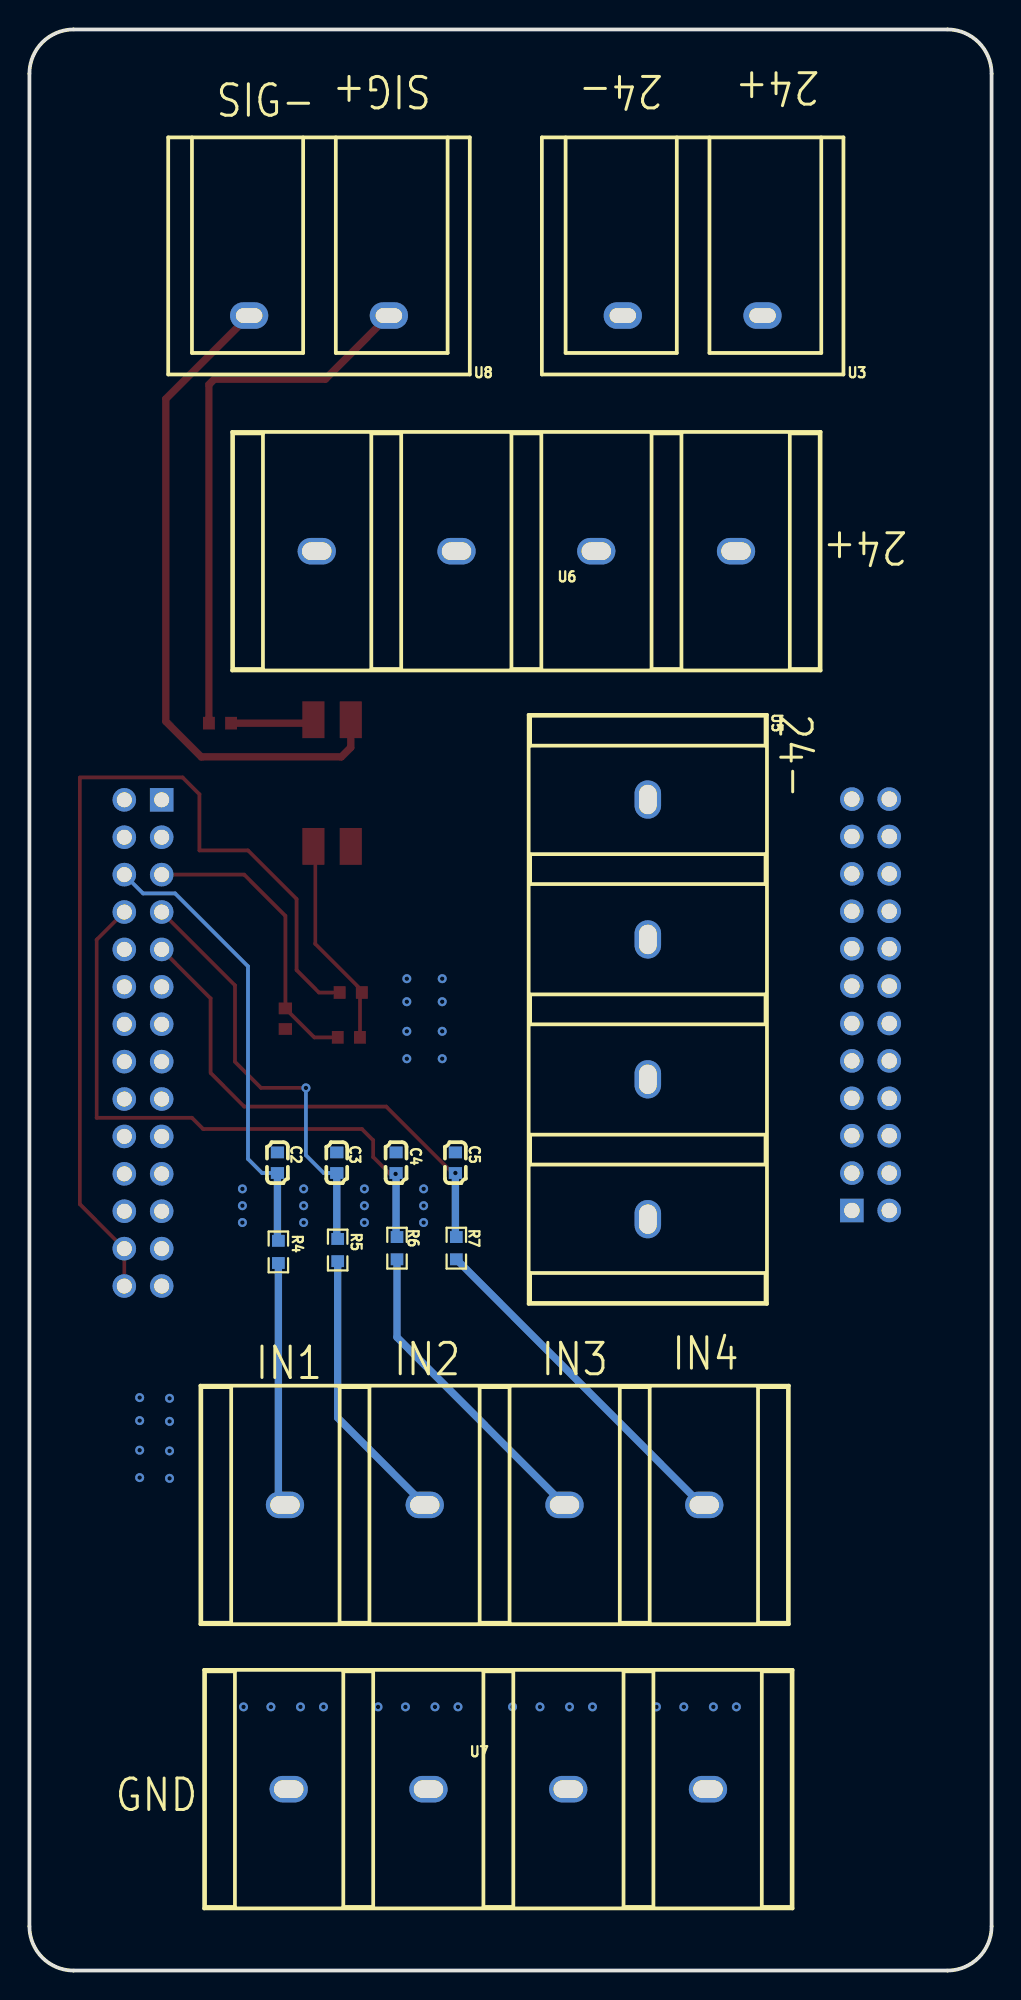
[diagram p8: board, bottom side, seen from below]

Outline 65.41 x 131.83 mm; copper layers: Top Layer, Bottom Layer. Coordinates in mm from the lower left corner of the outline.
Outline path: 0,128.83 0,3 arc(0.88,0.88) 3,0 62.41,0 arc(64.53,0.88) 65.41,3 65.41,128.83 arc(64.53,130.95) 62.41,131.83 3,131.83 arc(0.88,130.95) 0,128.83
Stack: Top Layer 0.035mm / Dielectric1 1.51mm FR4 er 4.5 / Bottom Layer 0.035mm

## Design rules (mm)
template: 自定义配置
spacing copperThickness1oz (default): track to track 0.102, other pairs 0.152 to 0.3
spacing copperThickness2oz: track to track 0.203, other pairs 0.152 to 0.3
track width copperThickness1oz (default): min 0.127, default 0.254, max 2.54
track width copperThickness2oz: min 0.203, default 0.254, max 2.54
differential pair differentialPair (default): width min 0.127, default 0.254, max 2.54; gap min 0.152, default 0.152
via viaSize (default): diameter min 0.5, default 0.61, max 10; hole min 0.3, default 0.305, max 6.3

## Placement (name value [footprint] x y rotation side)
C1  100nF  [C0603]  48.01 64.64 90 top
C2  100nF  [C0603]  48.55 54.86 270 bottom
C3  100nF  [C0603]  44.51 54.86 270 bottom
C4  100nF  [C0603]  40.48 54.86 270 bottom
C5  100nF  [C0603]  36.45 54.86 270 bottom
H1  PM254-2-12-Z-8.5  [HDR-TH_24P-P2.54-V-F-R2-C12-S2.54-2]  8.23 65.59 90 top
R1  10k  [R0603]  43.56 66.42 0 top
R2  10k  [R0603]  52.45 84.71 0 top
R3  10k  [R0603]  43.69 63.37 180 top
R4  10k  [R0603]  48.48 48.81 90 bottom
R5  10k  [R0603]  44.45 48.93 90 bottom
R6  10k  [R0603]  40.42 49.06 90 bottom
R7  10k  [R0603]  36.39 49.06 90 bottom
U1  PM254-2-14-Z-8.5  [HDR-TH_28P-P2.54-V-F-R2-C14-S2.54-1]  57.68 63 270 top
U2  PC817C  [OPTO-SMD-4_L4.6-W6.5-P2.54-LS10.3-TL]  44.83 80.65 270 top
U3  JL950M-95002B01  [CONN-TH_JL950M-95002B01]  20.32 112.4 0 bottom
U4  JL45C-09504B01  [CONN-TH_JL45C-09504B01]  33.78 31.62 0 bottom
U5  JL45C-09504B01  [CONN-TH_JL45C-09504B01]  23.37 65.28 270 bottom
U6  JL45C-09504B01  [CONN-TH_JL45C-09504B01]  31.62 96.39 0 bottom
U7  JL45C-09504B01  [CONN-TH_JL45C-09504B01]  33.53 12.32 180 bottom
U8  JL950M-95002B01  [CONN-TH_JL950M-95002B01]  45.72 112.4 0 bottom

## Footprints (pads in the part's own frame, mm; a bottom-side part is the same pattern mirrored in y, then rotated)
C0603
  rect 0.8x0.9 smd: 1(-0.7,0) 2(0.7,0)
CONN-TH_JL45C-09504B01
  oval 2.6x1.8 hole 2x1.2: 1(-14.25,0) 2(-4.75,0) 3(4.75,0) 4(14.25,0)
CONN-TH_JL950M-95002B01
  oval 2.6x1.8 hole 1.8x1: 1(-4.75,0) 2(4.75,0)
HDR-TH_24P-P2.54-V-F-R2-C12-S2.54-2
  rect 1.6x1.6 hole 1.05: 1(-13.97,-1.27)
  round 1.6 hole 1.05: 2(-13.97,1.27) 3(-11.43,-1.27) 4(-11.43,1.27) 5(-8.89,-1.27) 6(-8.89,1.27) 7(-6.35,-1.27) 8(-6.35,1.27) 9(-3.81,-1.27) 10(-3.81,1.27) 11(-1.27,-1.27) 12(-1.27,1.27) 13(1.27,-1.27) 14(1.27,1.27) 15(3.81,-1.27) 16(3.81,1.27) 17(6.35,-1.27) 18(6.35,1.27) 19(8.89,-1.27) 20(8.89,1.27) 21(11.43,-1.27) 22(11.43,1.27) 23(13.97,-1.27) 24(13.97,1.27)
HDR-TH_28P-P2.54-V-F-R2-C14-S2.54-1
  rect 1.6x1.6 hole 1.02: 1(-16.51,-1.27)
  round 1.6 hole 1.02: 2(-16.51,1.27) 3(-13.97,-1.27) 4(-13.97,1.27) 5(-11.43,-1.27) 6(-11.43,1.27) 7(-8.89,-1.27) 8(-8.89,1.27) 9(-6.35,-1.27) 10(-6.35,1.27) 11(-3.81,-1.27) 12(-3.81,1.27) 13(-1.27,-1.27) 14(-1.27,1.27) 15(1.27,-1.27) 16(1.27,1.27) 17(3.81,-1.27) 18(3.81,1.27) 19(6.35,-1.27) 20(6.35,1.27) 21(8.89,-1.27) 22(8.89,1.27) 23(11.43,-1.27) 24(11.43,1.27) 25(13.97,-1.27) 26(13.97,1.27) 27(16.51,-1.27) 28(16.51,1.27)
OPTO-SMD-4_L4.6-W6.5-P2.54-LS10.3-TL
  rect 2.5x1.5 smd: 1(-4.3,1.27) 2(-4.3,-1.27) 3(4.3,-1.27) 4(4.3,1.27)
R0603
  rect 0.806x0.864 smd: 1(-0.753,0) 2(0.753,0)

## Nets
As in the schematic.

Pads without a net: H1 1 2 3 4 5 6 7 8 9 10 11 12 13 14 15 16 17 18 19 20 21 22 23 24; U1 1 2 3 4 10 11 12 13 14 15 16 17 18 19 20 21 22 23 24

## Via types
v1: diameter 0.61, hole 0.305, Top Layer to Bottom Layer, 47 vias

## Routing (per net, layer and track width the routed paths; a pad name or vN(x,y) marks a point on that pad's centre or on a via; arc(x,y) is an arc through that point)
3V3: length 64.6
  Top Layer w0.254: U1.28 U1.26 61.98,52.05 61.98,81.03 54.99,81.03 53.85,79.88 53.85,76.07 50.55,76.07 47.24,72.77 47.24,67.95 45.72,66.42 R1.2
GND:
  vias: v1(17.35,17.91) v1(18.91,17.91) v1(20.92,17.91) v1(22.78,17.91) v1(27.13,17.91) v1(28.69,17.91) v1(30.7,17.91) v1(32.56,17.91) v1(36.27,17.91) v1(37.34,67.36) v1(37.34,65.8) v1(37.34,63.79) v1(37.34,61.93) v1(37.84,17.91) v1(38.61,53.09) v1(38.61,51.94) v1(38.61,50.8) v1(39.75,67.36) v1(39.75,65.8) v1(39.75,63.79) v1(39.75,61.93) v1(39.85,17.91) v1(41.71,17.91) v1(42.64,53.09) v1(42.64,51.94) v1(42.64,50.8) v1(45.42,17.91) v1(46.76,53.09) v1(46.76,51.94) v1(46.76,50.8) v1(46.98,17.91) v1(48.99,17.91) v1(50.85,17.91) v1(50.93,53.09) v1(50.93,51.94) v1(50.93,50.8) v1(55.88,38.86) v1(55.88,37.3) v1(55.88,35.29) v1(55.88,33.43) v1(57.91,38.91) v1(57.91,37.35) v1(57.91,35.34) v1(57.91,33.48)
ADC0: length 20.2
  Top Layer w0.254: R3.1 46.04,63.37 C1.2 48.01,71.63 50.8,74.43 U1.5
ADC1: length 31.1
  Bottom Layer w0.254: C2.2 49.59,54.16 50.55,55.12 50.55,68.2 55.5,73.15 57.68,73.15 U1.6
  Bottom Layer w0.5: C2.2 48.55,49.62 48.48,49.56
ADC2: length 29.5
  Top Layer w0.254: v1(46.61,59.94) 49.66,59.94 51.44,61.72 51.44,66.91 U1.7
  Bottom Layer w0.254: v1(46.61,59.94) 46.61,55.37 45.4,54.16 C3.2
  Bottom Layer w0.5: C3.2 44.51,49.75 R5.2
ADC3: length 41.7
  Top Layer w0.254: U1.8 60.83,70.01 60.83,57.91 54.36,57.91 53.59,57.15 42.8,57.15 42.04,56.39 42.04,55.25 40.89,54.1 v1(40.51,54.1)
  Bottom Layer w0.5: R6.2 40.48,49.88 C4.2
ADC4: length 33.5
  Top Layer w0.254: 36.58,54.1 41.15,58.67 50.8,58.67 53.09,60.96 53.09,66.02 U1.9
  Bottom Layer w0.5: R7.2 36.45,49.88 v1(36.45,54.16)
PLC+: length 37.2
  Top Layer w0.5: U8.1 45.29,108.08 52.83,108.08 53.2,107.7 R2.2
PLC-: length 45.2
  Top Layer w0.5: 43.56,84.56 43.56,83.06 44.2,82.42 53.72,82.42 56.13,84.84 56.13,106.73 U8.2
$1N1349: length 5.7
  Top Layer w0.5: R2.1 46.25,84.71 46.1,84.56
$1N4891: length 14.4
  Top Layer w0.254: R3.2 42.93,66.29 R1.1 42.81,66.56 45.97,69.72 45.97,76.22 U2.4
$1N4959: length 19
  Bottom Layer w0.5: U4.3 44.45,37.54 R5.1
$1N4997: length 21.4
  Bottom Layer w0.5: U4.2 40.42,43.01 R6.1
$1N5038: length 23.8
  Bottom Layer w0.5: R7.1 19.7,31.62 U4.1
$1N5356: length 16.6
  Bottom Layer w0.5: R4.1 48.48,32.07 U4.4

## Copper pours and planes (outline as drawn; the poured copper is in the pictures)
GND on Top Layer: 7.49,21.84 57.52,21.84 57.52,3.94 7.49,3.94
GND on Top Layer: 35.18,80.65 62.74,80.65 62.74,3.94 35.18,3.94
GND on Bottom Layer: 35.18,80.65 62.74,80.65 62.74,3.94 35.18,3.94
GND on Bottom Layer: 7.49,21.84 57.52,21.84 57.52,3.94 7.49,3.94
24+ on Bottom Layer: 9.65,105.37 52.07,105.37 52.07,88.14 9.65,88.14
24+ on Bottom Layer: 9.65,119.76 20.07,119.76 20.07,88.52 9.65,88.52
24- on Top Layer: 17.65,119.76 30.35,119.76 30.35,48.26 17.65,48.26

## Text on the board
Bottom Silkscreen Layer: IN4 | IN3 | IN2 | IN1 | SIG- | GND | 24+ | 24- | SIG+

# Board PCB6
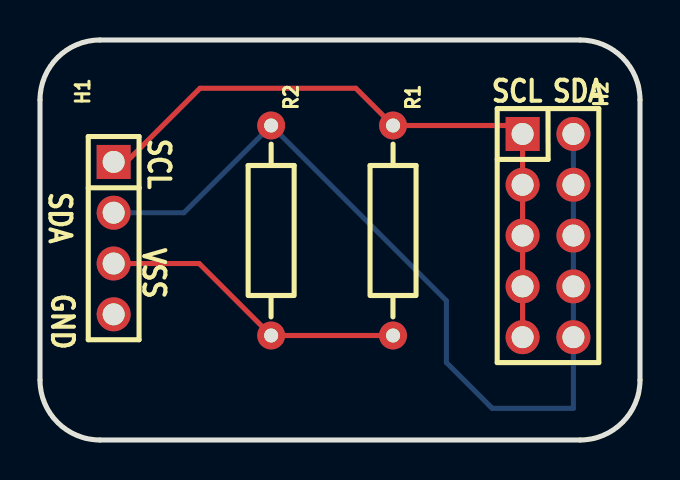
[diagram p9: board, top side]
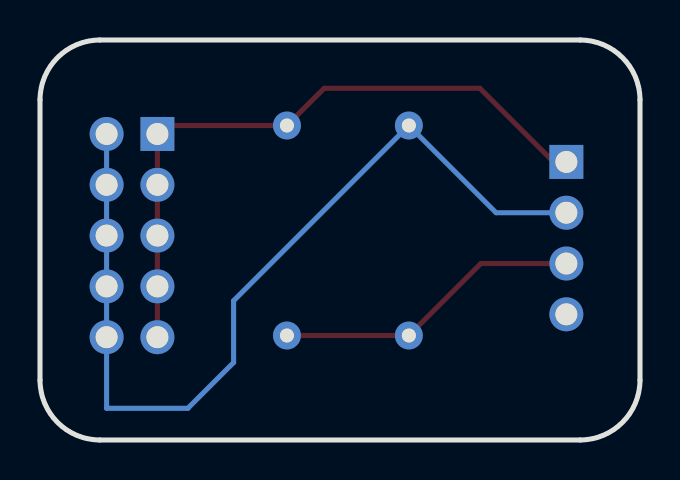
[diagram p10: board, bottom side, seen from below]

Outline 30 x 20 mm; copper layers: Top Layer, Bottom Layer. Coordinates in mm from the lower left corner of the outline.
Outline path: 0,17 0,3 arc(0.88,0.88) 3,0 27,0 arc(29.12,0.88) 30,3 30,17 arc(29.12,19.12) 27,20 3,20 arc(0.88,19.12) 0,17
Stack: Top Layer 0.035mm / Dielectric1 1.51mm FR4 er 4.5 / Bottom Layer 0.035mm

## Design rules (mm)
template: JLCPCB Capability(Two Layers Board)
spacing copperThickness1oz (default): track to track 0.102, other pairs 0.152 to 0.3
spacing copperThickness2oz: track to track 0.203, other pairs 0.152 to 0.3
track width copperThickness1oz (default): min 0.127, default 0.254, max 2.54
track width copperThickness2oz: min 0.203, default 0.254, max 2.54
differential pair differentialPair (default): width min 0.127, default 0.254, max 2.54; gap min 0.152, default 0.152
via viaSize (default): diameter min 0.5, default 0.61, max 10; hole min 0.3, default 0.305, max 6.3

## Placement (name value [footprint] x y rotation side)
H1  PZ254V-11-04P  [HDR-TH_4P-P2.54-V-M]  3.68 10.09 270 top
H2  PZ254V-12-10P  [HDR-TH_10P-P2.54-V-M-R2-C5-S2.54]  25.4 10.22 270 top
R1  4.7kΩ  [RES-TH_BD2.3-L6.5-P10.50-D0.5]  17.65 10.48 270 top
R2  4.7kΩ  [RES-TH_BD2.3-L6.5-P10.50-D0.5]  11.56 10.48 270 top

## Footprints (pads in the part's own frame, mm; a bottom-side part is the same pattern mirrored in y, then rotated)
HDR-TH_4P-P2.54-V-M
  rect 1.7x1.7 hole 1.1: 1(-3.81,0)
  round 1.7 hole 1.1: 2(-1.27,0) 3(1.27,0) 4(3.81,0)
HDR-TH_10P-P2.54-V-M-R2-C5-S2.54
  rect 1.7x1.7 hole 1.1: 1(-5.08,-1.27)
  round 1.7 hole 1.1: 2(-5.08,1.27) 3(-2.54,-1.27) 4(-2.54,1.27) 5(0,-1.27) 6(0,1.27) 7(2.54,-1.27) 8(2.54,1.27) 9(5.08,-1.27) 10(5.08,1.27)
RES-TH_BD2.3-L6.5-P10.50-D0.5
  round 1.4 hole 0.7: 1(-5.25,0) 2(5.25,0)

## Nets
As in the schematic.

## Routing (per net, layer and track width the routed paths; a pad name or vN(x,y) marks a point on that pad's centre or on a via; arc(x,y) is an arc through that point)
VSS: length 15.5
  Top Layer w0.254: R1.2 R2.2 7.96,8.82 H1.3
SCL: length 33.2
  Top Layer w0.254: 24.13,4.89 24.13,15.05 23.45,15.73 R1.1 15.79,17.59 8,17.59 4.32,13.9 H1.1
SDA: length 45.9
  Bottom Layer w0.254: H1.2 7.2,11.36 R2.1 20.32,6.96 20.32,3.87 22.61,1.59 26.67,1.59 26.67,15.05

## Text on the board
Top Silkscreen Layer: SCL | SDA | GND | VSS
